# EAGLE design BPC3010_Papilio_Plus (EAGLE 5.11)
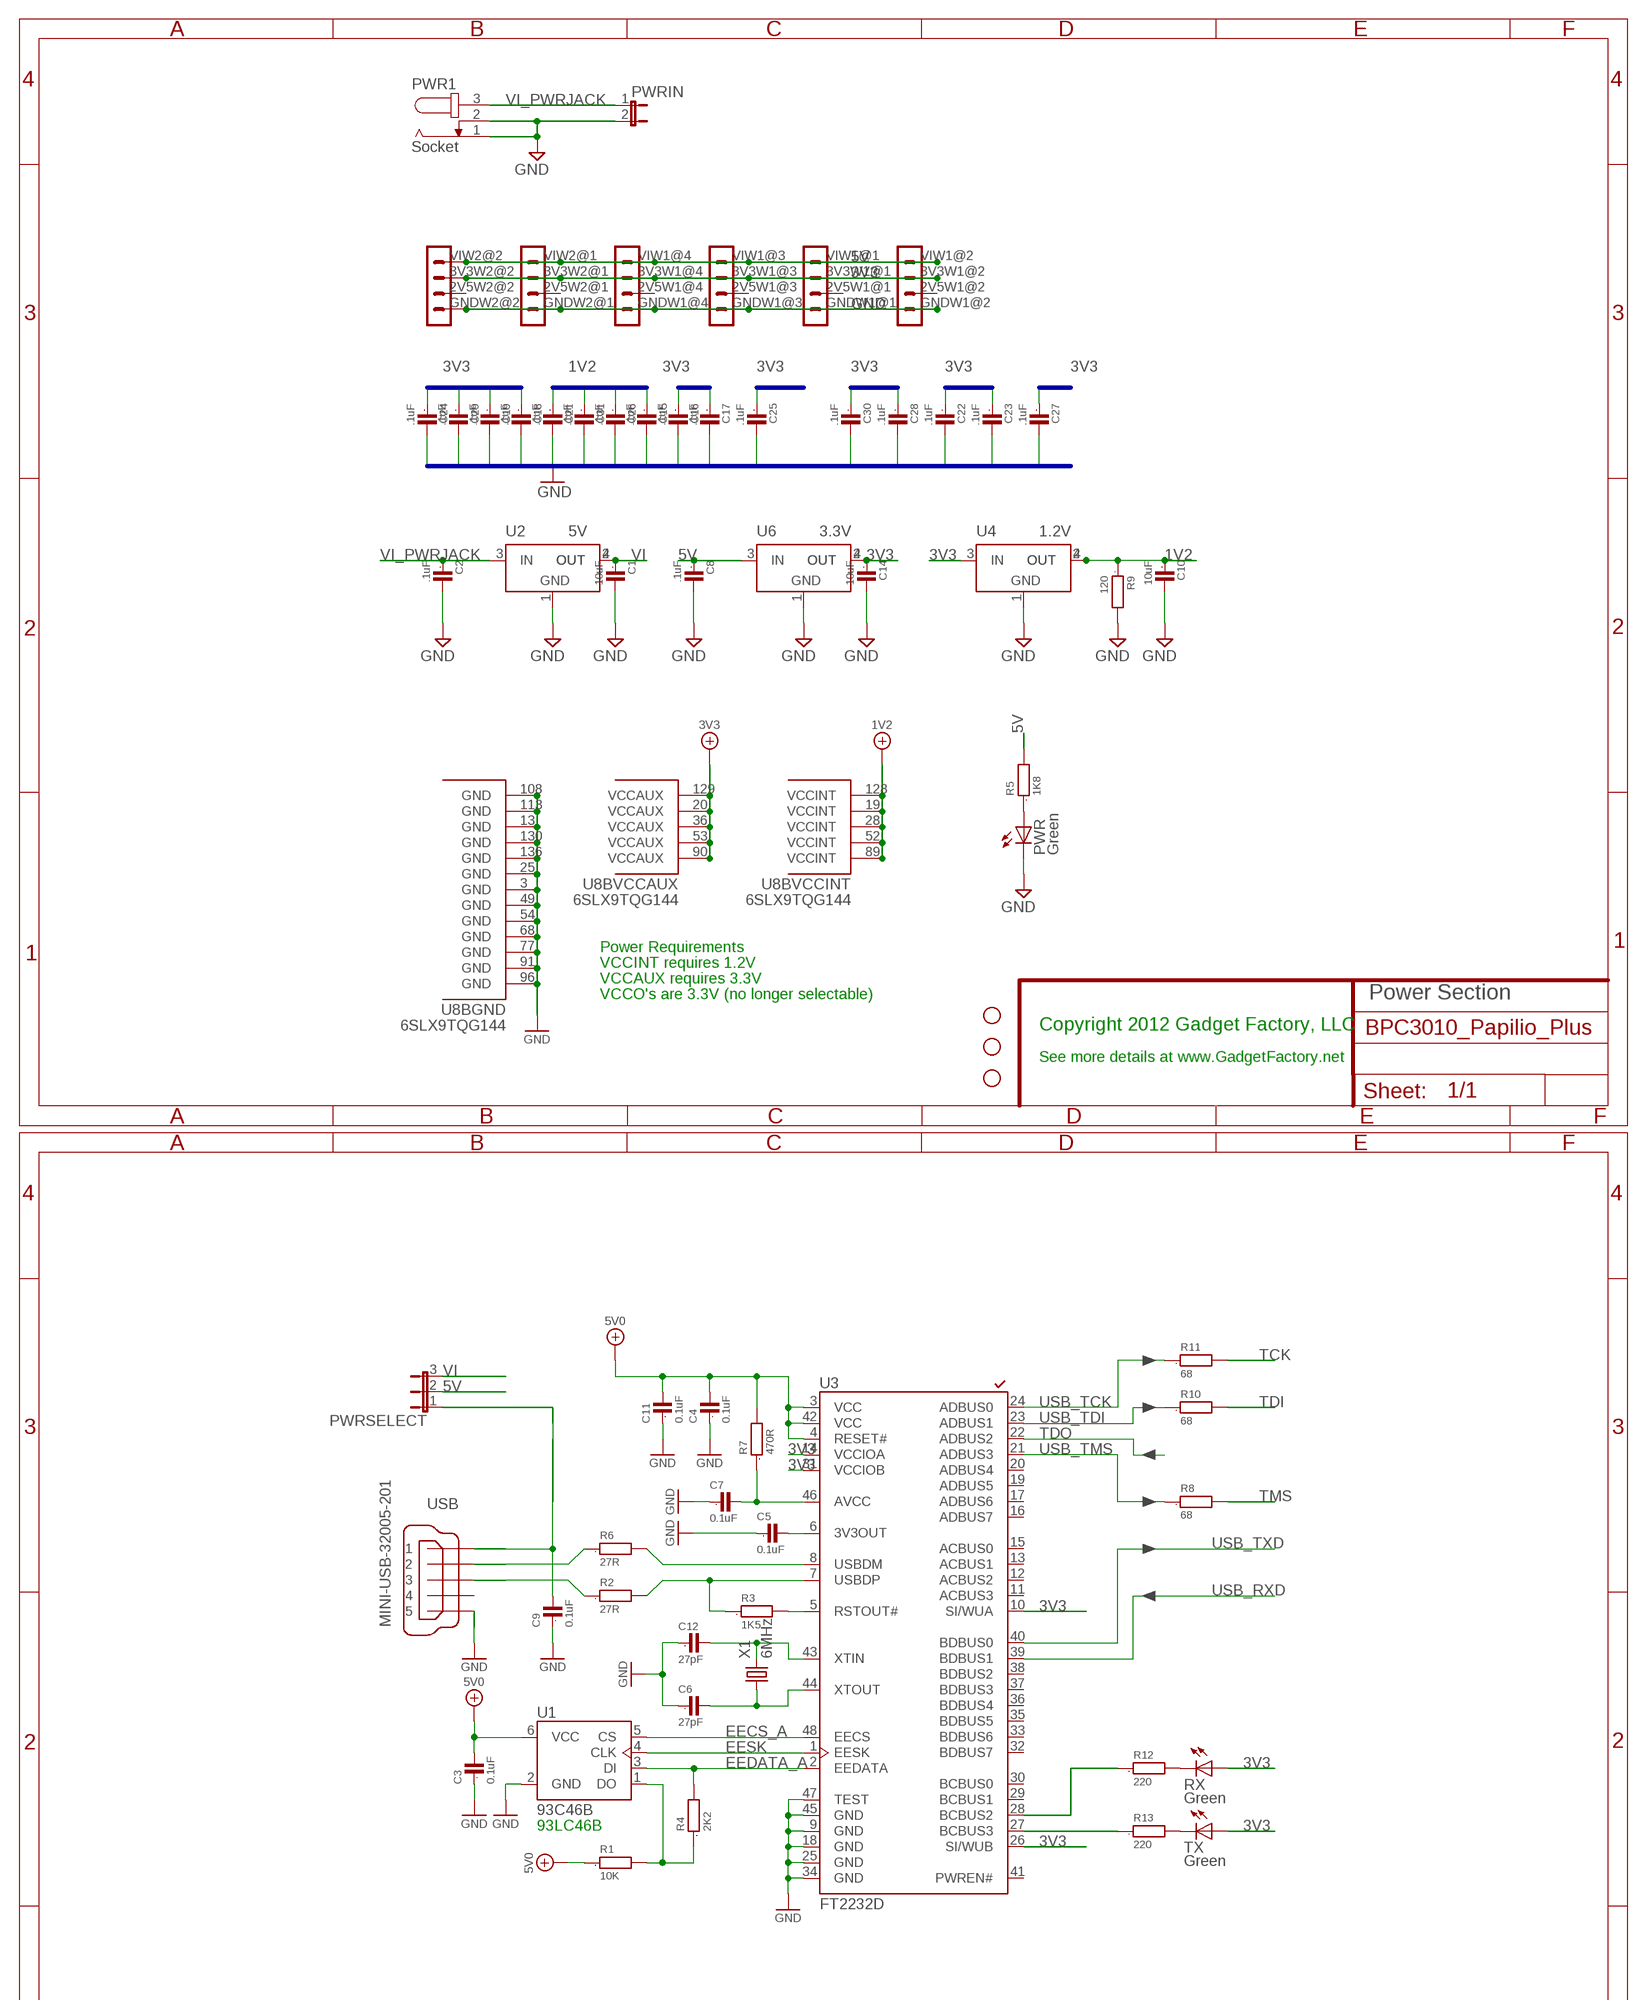
[diagram p0: schematic, sheet 1, part 1 of 2]
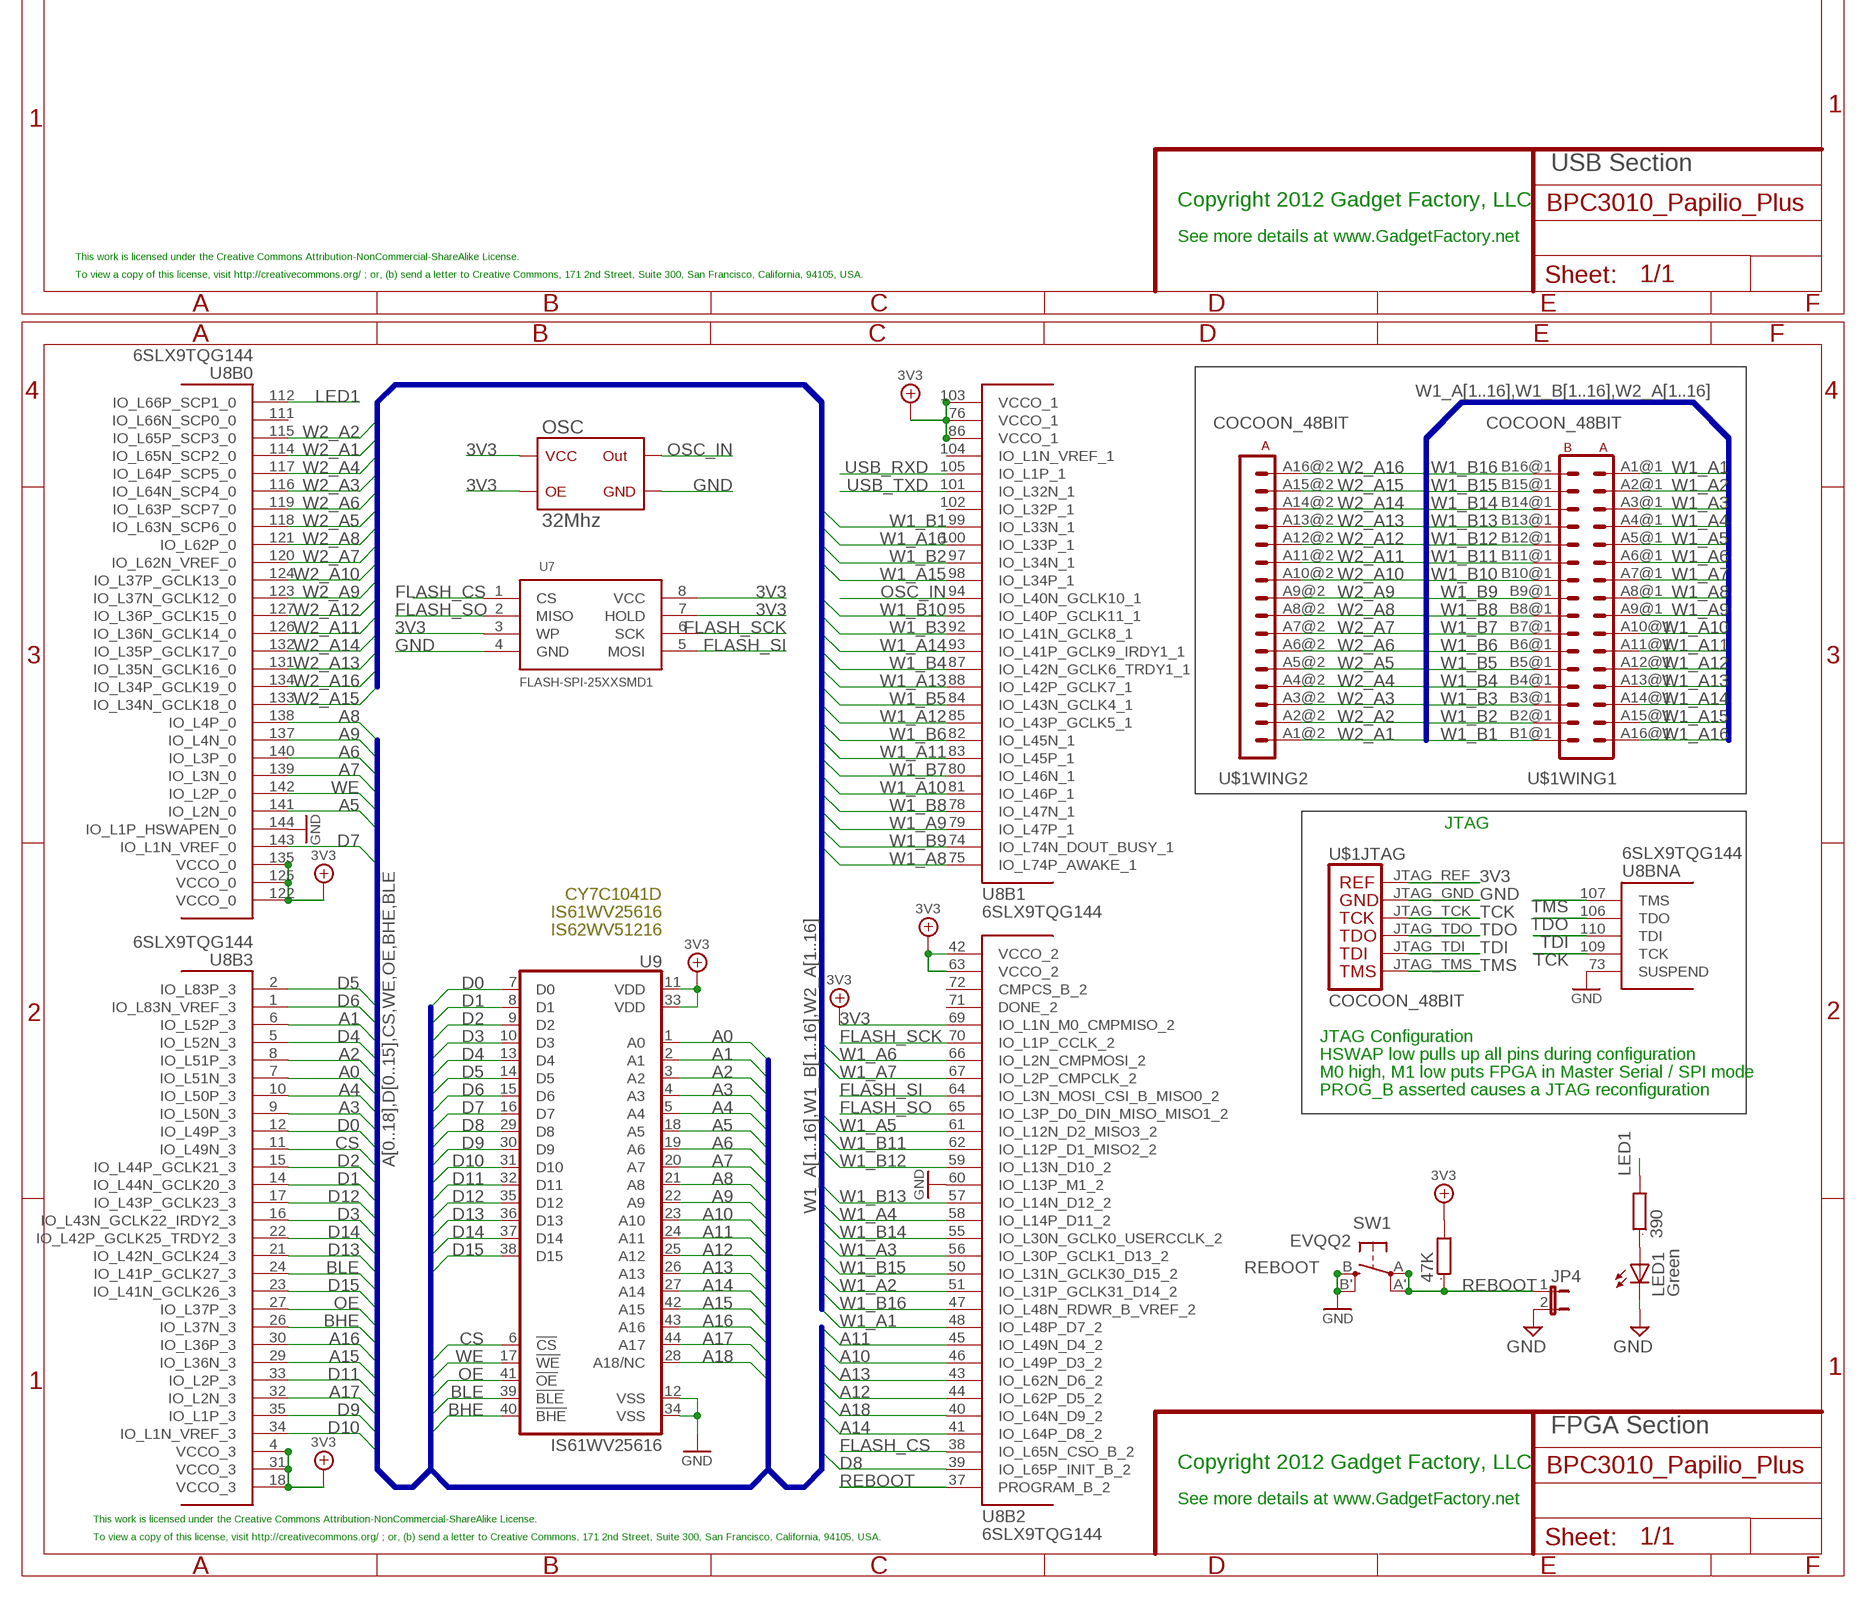
[diagram p1: schematic, sheet 1, part 2 of 2]

## Parts
C1  10uF  C0805  [0805]
C2  .1uF  C0805  [0805]
C3  0.1uF  C0805  [0805@2]
C4  0.1uF  C0805  [0805@2]
C5  0.1uF  C0805  [0805@2]
C6  27pF  C0805  [0805@2]
C7  0.1uF  C0805  [0805@2]
C8  .1uF  C0805  [0805]
C9  0.1uF  C0805  [0805@2]
C10  10uF  C0805  [0805]
C11  0.1uF  C0805  [0805@2]
C12  27pF  C0805  [0805@2]
C14  10uF  C0805  [0805]
C15  .1uF  C0603  [0603]
C16  .1uF  C0603  [0603]
C17  .1uF  C0603  [0603]
C18  .1uF  C0603  [0603]
C19  .1uF  C0603  [0603]
C21  .1uF  C0603  [0603]
C22  .1uF  C0603  [0603]
C23  .1uF  C0603  [0603]
C24  .1uF  C0603  [0603]
C25  .1uF  C0603  [0603]
C26  .1uF  C0603  [0603]
C27  .1uF  C0603  [0603]
C28  .1uF  C0603  [0603]
C29  .1uF  C0603  [0603]
C30  .1uF  C0603  [0603]
C31  .1uF  C0603  [0603]
JP1  STAND-OFF  [STAND-OFF]
JP2  STAND-OFF  [STAND-OFF]
JP3  STAND-OFF  [STAND-OFF]
JP4  JP1E  [JP1]
LED1  Green  LEDCHIPLED_0805  [CHIPLED_0805]
OSC  32Mhz  OSC1  [OSC1]
PWR  Green  LEDCHIP-LED0805  [CHIP-LED0805]
PWR1  Socket  JACK-PLUG  [SPC4078-NOSLOT]
PWRIN  JP1E  [JP1]
PWRSELECT  JP2E  [JP2]
R1  10K  R0805  [0805@1]
R2  27R  R0805  [0805@1]
R3  1K5  R0805  [0805@1]
R4  2K2  R0805  [0805@1]
R5  1K8  R0805  [0805]
R6  27R  R0805  [0805@1]
R7  470R  R0805  [0805@1]
R8  68  R0805  [0805]
R9  120  R0805  [0805@1]
R10  68  R0805  [0805]
R11  68  R0805  [0805]
R12  220  R0805  [0805]
R13  220  R0805  [0805]
R33  47K  R0805  [0805]
R37  390  R0805  [0805]
RX  Green  LEDCHIP-LED0805  [CHIP-LED0805]
SW1  EVQQ2  [EVQ-Q2]
TX  Green  LEDCHIP-LED0805  [CHIP-LED0805]
U1  93C46B  DIGITAL-EEPROM-MICROWIRE-6P_SOT23  [SOT23-6]
U2  5V  LD1117  [SOT223]
U3  FT2232D  [LQFP48]
U4  1.2V  LD1117  [SOT223]
U6  3.3V  LD1117  [SOT223]
U7  FLASH-SPI-25XXSMD1  [SO08-EIAJ]
U8  6SLX9TQG144  [TQ144]
U9  IS61WV25616  DIGITAL_4MB_SRAM  [TSOP44-II]
U$1  COCOON_48BIT  [COCOON_48BIT]
USB  MINI-USB-32005-201  [32005-201]
X1  6MHz  CRYSTALHC49S  [HC49/S]

## Nets
1V2: C10.1 C15.1 C21.1 C26.1 C31.1 R9.1 U4.2(OUT) U4.4(OUT) U8.19(BVCCINT:VCCINT) U8.28(BVCCINT:VCCINT) U8.52(BVCCINT:VCCINT) U8.89(BVCCINT:VCCINT) U8.128(BVCCINT:VCCINT)
3V3: C14.1 C16.1 C17.1 C18.1 C19.1 C22.1 C23.1 C24.1 C25.1 C27.1 C28.1 C29.1 C30.1 OSC.1@1(OE) OSC.4@4(VCC) R33.2 RX.A TX.A U3.10(SI/WUA) U3.14(VCCIOA) U3.26(SI/WUB) U3.31(VCCIOB) U4.3(IN) U6.2(OUT) U6.4(OUT) U7.3(WP) U7.7(HOLD) U7.8(VCC) U8.4(B3:VCCO_3) U8.18(B3:VCCO_3) U8.20(BVCCAUX:VCCAUX) U8.31(B3:VCCO_3) U8.36(BVCCAUX:VCCAUX) U8.42(B2:VCCO_2) U8.53(BVCCAUX:VCCAUX) U8.63(B2:VCCO_2) U8.69(B2:IO_L1N_M0_CMPMISO_2) U8.76(B1:VCCO_1) U8.86(B1:VCCO_1) U8.90(BVCCAUX:VCCAUX) U8.103(B1:VCCO_1) U8.122(B0:VCCO_0) U8.125(B0:VCCO_0) U8.129(BVCCAUX:VCCAUX) U8.135(B0:VCCO_0) U9.11(VDD) U9.33(VDD) U$1.3V3W1@1(3V3) U$1.3V3W1@2(3V3) U$1.3V3W1@3(3V3) U$1.3V3W1@4(3V3) U$1.3V3W2@1(3V3) U$1.3V3W2@2(3V3) U$1.JTAG_REF(JTAG:JTAG_REF)
3V3OUT_A: C5.2 U3.6(3V3OUT)
5V: C3.2 C4.2 C8.1 C11.2 PWRSELECT.2 R1.1 R5.2 R7.2 U1.6(VCC) U3.3(VCC) U3.4(RESET#) U3.42(VCC) U6.3(IN) U$1.VIW1@1(5V) U$1.VIW1@2(5V) U$1.VIW1@3(5V) U$1.VIW1@4(5V) U$1.VIW2@1(5V) U$1.VIW2@2(5V) ; supply symbol labelled 5V0
A0: U8.7(B3:IO_L51N_3) U9.1(A0)
A1: U8.6(B3:IO_L52P_3) U9.2(A1)
A2: U8.8(B3:IO_L51P_3) U9.3(A2)
A3: U8.9(B3:IO_L50N_3) U9.4(A3)
A4: U8.10(B3:IO_L50P_3) U9.5(A4)
A5: U8.141(B0:IO_L2N_0) U9.18(A5)
A6: U8.140(B0:IO_L3P_0) U9.19(A6)
A7: U8.139(B0:IO_L3N_0) U9.20(A7)
A8: U8.138(B0:IO_L4P_0) U9.21(A8)
A9: U8.137(B0:IO_L4N_0) U9.22(A9)
A10: U8.46(B2:IO_L49P_D3_2) U9.23(A10)
A11: U8.45(B2:IO_L49N_D4_2) U9.24(A11)
A12: U8.44(B2:IO_L62P_D5_2) U9.25(A12)
A13: U8.43(B2:IO_L62N_D6_2) U9.26(A13)
A14: U8.41(B2:IO_L64P_D8_2) U9.27(A14)
A15: U8.29(B3:IO_L36N_3) U9.42(A15)
A16: U8.30(B3:IO_L36P_3) U9.43(A16)
A17: U8.32(B3:IO_L2N_3) U9.44(A17)
A18: U8.40(B2:IO_L64N_D9_2) U9.28(A18/NC)
BHE: U8.26(B3:IO_L37N_3) U9.40(!BHE)
BLE: U8.24(B3:IO_L41P_GCLK27_3) U9.39(!BLE)
CS: U8.11(B3:IO_L49N_3) U9.6(!CS)
D0: U8.12(B3:IO_L49P_3) U9.7(D0)
D1: U8.14(B3:IO_L44N_GCLK20_3) U9.8(D1)
D2: U8.15(B3:IO_L44P_GCLK21_3) U9.9(D2)
D3: U8.16(B3:IO_L43N_GCLK22_IRDY2_3) U9.10(D3)
D4: U8.5(B3:IO_L52N_3) U9.13(D4)
D5: U8.2(B3:IO_L83P_3) U9.14(D5)
D6: U8.1(B3:IO_L83N_VREF_3) U9.15(D6)
D7: U8.143(B0:IO_L1N_VREF_0) U9.16(D7)
D8: U8.39(B2:IO_L65P_INIT_B_2) U9.29(D8)
D9: U8.35(B3:IO_L1P_3) U9.30(D9)
D10: U8.34(B3:IO_L1N_VREF_3) U9.31(D10)
D11: U8.33(B3:IO_L2P_3) U9.32(D11)
D12: U8.17(B3:IO_L43P_GCLK23_3) U9.35(D12)
D13: U8.21(B3:IO_L42N_GCLK24_3) U9.36(D13)
D14: U8.22(B3:IO_L42P_GCLK25_TRDY2_3) U9.37(D14)
D15: U8.23(B3:IO_L41N_GCLK26_3) U9.38(D15)
D+: R2.1 USB.3
D-: R6.1 USB.2
DO_A: R1.2 R4.1 U1.1(DO)
EECS_A: U1.5(CS) U3.48(EECS)
EEDATA_A: R4.2 U1.3(DI) U3.2(EEDATA)
EESK: U1.4(CLK) U3.1(EESK)
FILTERED_VCC_A: C7.2 R7.1 U3.46(AVCC)
FLASH_CS: U7.1(CS) U8.38(B2:IO_L65N_CSO_B_2)
FLASH_SCK: U7.6(SCK) U8.70(B2:IO_L1P_CCLK_2)
FLASH_SI: U7.5(MOSI) U8.64(B2:IO_L3N_MOSI_CSI_B_MISO0_2)
FLASH_SO: U7.2(MISO) U8.65(B2:IO_L3P_D0_DIN_MISO_MISO1_2)
GND: C1.2 C2.2 C3.1 C4.1 C5.1 C6.1 C7.1 C8.2 C9.1 C10.2 C11.1 C12.1 C14.2 C15.2 C16.2 C17.2 C18.2 C19.2 C21.2 C22.2 C23.2 C24.2 C25.2 C26.2 C27.2 C28.2 C29.2 C30.2 C31.2 JP4.2 LED1.C OSC.2@2(GND) PWR1.1 PWR1.2 PWR.C PWRIN.2 R9.2 SW1.B'(S1) SW1.B(S) U1.2(GND) U2.1(GND) U3.9(GND) U3.18(GND) U3.25(GND) U3.34(GND) U3.45(GND) U3.47(TEST) U4.1(GND) U6.1(GND) U7.4(GND) U8.3(BGND:GND) U8.13(BGND:GND) U8.25(BGND:GND) U8.49(BGND:GND) U8.54(BGND:GND) U8.60(B2:IO_L13P_M1_2) U8.68(BGND:GND) U8.73(BNA:SUSPEND) U8.77(BGND:GND) U8.91(BGND:GND) U8.96(BGND:GND) U8.108(BGND:GND) U8.113(BGND:GND) U8.130(BGND:GND) U8.136(BGND:GND) U8.144(B0:IO_L1P_HSWAPEN_0) U9.12(VSS) U9.34(VSS) U$1.GNDW1@1(GND) U$1.GNDW1@2(GND) U$1.GNDW1@3(GND) U$1.GNDW1@4(GND) U$1.GNDW2@1(GND) U$1.GNDW2@2(GND) U$1.JTAG_GND(JTAG:JTAG_GND) USB.5
LED1: R37.2 U8.112(B0:IO_L66P_SCP1_0)
N$1: PWR.A R5.1
N$2: R12.2 RX.C
N$3: R13.2 TX.C
N$4: R13.1 U3.27(BCBUS3)
N$5: R12.1 U3.28(BCBUS2)
N$7: LED1.A R37.1
N$15_A: R3.2 U3.5(RSTOUT#)
OE: U8.27(B3:IO_L37P_3) U9.41(!OE)
OSC_IN: OSC.3@3(OUT) U8.94(B1:IO_L40N_GCLK10_1)
REBOOT: JP4.1 R33.1 SW1.A'(P1) SW1.A(P) U8.37(B2:PROGRAM_B_2)
TCK: R11.2 U8.109(BNA:TCK) U$1.JTAG_TCK(JTAG:JTAG_TCK)
TDI: R10.2 U8.110(BNA:TDI) U$1.JTAG_TDI(JTAG:JTAG_TDI)
TDO: U3.22(ADBUS2) U8.106(BNA:TDO) U$1.JTAG_TDO(JTAG:JTAG_TDO)
TMS: R8.2 U8.107(BNA:TMS) U$1.JTAG_TMS(JTAG:JTAG_TMS)
USB_RXD: U3.39(BDBUS1) U8.105(B1:IO_L1P_1)
USB_TCK: R11.1 U3.24(ADBUS0)
USB_TDI: R10.1 U3.23(ADBUS1)
USB_TMS: R8.1 U3.21(ADBUS3)
USB_TXD: U3.40(BDBUS0) U8.101(B1:IO_L32N_1)
USBDM_A: R6.2 U3.8(USBDM)
USBDP_A: R2.2 R3.1 U3.7(USBDP)
VBUS_A: C9.2 PWRSELECT.1 USB.1
VI: C1.1 PWRSELECT.3 U2.2(OUT) U2.4(OUT)
VI_PWRJACK: C2.1 PWR1.3 PWRIN.1 U2.3(IN)
W1_A1: U8.48(B2:IO_L48P_D7_2) U$1.A1@1(WING1:A1)
W1_A2: U8.51(B2:IO_L31P_GCLK31_D14_2) U$1.A2@1(WING1:A2)
W1_A3: U8.56(B2:IO_L30P_GCLK1_D13_2) U$1.A3@1(WING1:A3)
W1_A4: U8.58(B2:IO_L14P_D11_2) U$1.A4@1(WING1:A4)
W1_A5: U8.61(B2:IO_L12N_D2_MISO3_2) U$1.A5@1(WING1:A5)
W1_A6: U8.66(B2:IO_L2N_CMPMOSI_2) U$1.A6@1(WING1:A6)
W1_A7: U8.67(B2:IO_L2P_CMPCLK_2) U$1.A7@1(WING1:A7)
W1_A8: U8.75(B1:IO_L74P_AWAKE_1) U$1.A8@1(WING1:A8)
W1_A9: U8.79(B1:IO_L47P_1) U$1.A9@1(WING1:A9)
W1_A10: U8.81(B1:IO_L46P_1) U$1.A10@1(WING1:A10)
W1_A11: U8.83(B1:IO_L45P_1) U$1.A11@1(WING1:A11)
W1_A12: U8.85(B1:IO_L43P_GCLK5_1) U$1.A12@1(WING1:A12)
W1_A13: U8.88(B1:IO_L42P_GCLK7_1) U$1.A13@1(WING1:A13)
W1_A14: U8.93(B1:IO_L41P_GCLK9_IRDY1_1) U$1.A14@1(WING1:A14)
W1_A15: U8.98(B1:IO_L34P_1) U$1.A15@1(WING1:A15)
W1_A16: U8.100(B1:IO_L33P_1) U$1.A16@1(WING1:A16)
W1_B1: U8.99(B1:IO_L33N_1) U$1.B1@1(WING1:B1)
W1_B2: U8.97(B1:IO_L34N_1) U$1.B2@1(WING1:B2)
W1_B3: U8.92(B1:IO_L41N_GCLK8_1) U$1.B3@1(WING1:B3)
W1_B4: U8.87(B1:IO_L42N_GCLK6_TRDY1_1) U$1.B4@1(WING1:B4)
W1_B5: U8.84(B1:IO_L43N_GCLK4_1) U$1.B5@1(WING1:B5)
W1_B6: U8.82(B1:IO_L45N_1) U$1.B6@1(WING1:B6)
W1_B7: U8.80(B1:IO_L46N_1) U$1.B7@1(WING1:B7)
W1_B8: U8.78(B1:IO_L47N_1) U$1.B8@1(WING1:B8)
W1_B9: U8.74(B1:IO_L74N_DOUT_BUSY_1) U$1.B9@1(WING1:B9)
W1_B10: U8.95(B1:IO_L40P_GCLK11_1) U$1.B10@1(WING1:B10)
W1_B11: U8.62(B2:IO_L12P_D1_MISO2_2) U$1.B11@1(WING1:B11)
W1_B12: U8.59(B2:IO_L13N_D10_2) U$1.B12@1(WING1:B12)
W1_B13: U8.57(B2:IO_L14N_D12_2) U$1.B13@1(WING1:B13)
W1_B14: U8.55(B2:IO_L30N_GCLK0_USERCCLK_2) U$1.B14@1(WING1:B14)
W1_B15: U8.50(B2:IO_L31N_GCLK30_D15_2) U$1.B15@1(WING1:B15)
W1_B16: U8.47(B2:IO_L48N_RDWR_B_VREF_2) U$1.B16@1(WING1:B16)
W2_A1: U8.114(B0:IO_L65N_SCP2_0) U$1.A1@2(WING2:A1)
W2_A2: U8.115(B0:IO_L65P_SCP3_0) U$1.A2@2(WING2:A2)
W2_A3: U8.116(B0:IO_L64N_SCP4_0) U$1.A3@2(WING2:A3)
W2_A4: U8.117(B0:IO_L64P_SCP5_0) U$1.A4@2(WING2:A4)
W2_A5: U8.118(B0:IO_L63N_SCP6_0) U$1.A5@2(WING2:A5)
W2_A6: U8.119(B0:IO_L63P_SCP7_0) U$1.A6@2(WING2:A6)
W2_A7: U8.120(B0:IO_L62N_VREF_0) U$1.A7@2(WING2:A7)
W2_A8: U8.121(B0:IO_L62P_0) U$1.A8@2(WING2:A8)
W2_A9: U8.123(B0:IO_L37N_GCLK12_0) U$1.A9@2(WING2:A9)
W2_A10: U8.124(B0:IO_L37P_GCLK13_0) U$1.A10@2(WING2:A10)
W2_A11: U8.126(B0:IO_L36N_GCLK14_0) U$1.A11@2(WING2:A11)
W2_A12: U8.127(B0:IO_L36P_GCLK15_0) U$1.A12@2(WING2:A12)
W2_A13: U8.131(B0:IO_L35N_GCLK16_0) U$1.A13@2(WING2:A13)
W2_A14: U8.132(B0:IO_L35P_GCLK17_0) U$1.A14@2(WING2:A14)
W2_A15: U8.133(B0:IO_L34N_GCLK18_0) U$1.A15@2(WING2:A15)
W2_A16: U8.134(B0:IO_L34P_GCLK19_0) U$1.A16@2(WING2:A16)
WE: U8.142(B0:IO_L2P_0) U9.17(!WE)
XTIN_A: C12.2 U3.43(XTIN) X1.2
XTOUT_A: C6.2 U3.44(XTOUT) X1.1
Unconnected: U3.11(ACBUS3) U3.12(ACBUS2) U3.13(ACBUS1) U3.15(ACBUS0) U3.16(ADBUS7) U3.17(ADBUS6) U3.19(ADBUS5) U3.20(ADBUS4) U3.29(BCBUS1) U3.30(BCBUS0) U3.32(BDBUS7) U3.33(BDBUS6) U3.35(BDBUS5) U3.36(BDBUS4) U3.37(BDBUS3) U3.38(BDBUS2) U3.41(PWREN#) U8.71(B2:DONE_2) U8.72(B2:CMPCS_B_2) U8.102(B1:IO_L32P_1) U8.104(B1:IO_L1N_VREF_1) U8.111(B0:IO_L66N_SCP0_0) U$1.2V5W1@1(2V5) U$1.2V5W1@2(2V5) U$1.2V5W1@3(2V5) U$1.2V5W1@4(2V5) U$1.2V5W2@1(2V5) U$1.2V5W2@2(2V5) USB.4

## Buses
GND
1V2
W1_A[1..16],W1_B[1..16],W2_A[1..16]
3V3
A[0..18],D[0..15],CS,WE,OE,BHE,BLE

## Notes on the sheet
- Power Requirements
- VCCINT requires 1.2V
- VCCAUX requires 3.3V
- VCCO's are 3.3V (no longer selectable) | Power Section
- Copyright 2012 Gadget Factory, LLC
- See more details at www.GadgetFactory.net
- 93LC46B
- USB Section
- Copyright 2012 Gadget Factory, LLC
- See more details at www.GadgetFactory.net
- This work is licensed under the Creative Commons Attribution-NonCommercial-ShareAlike License.
- To view a copy of this license, visit http://creativecommons.org/ ; or, (b) send a letter to Creative Commons, 171 2nd Street, Suite 300, San Francisco, California, 94105, USA.
- JTAG
- CY7C1041D
- IS61WV25616
- IS62WV51216
- JTAG Configuration
- HSWAP low pulls up all pins during configuration
- M0 high, M1 low puts FPGA in Master Serial / SPI mode
- PROG_B asserted causes a JTAG reconfiguration
- REBOOT
- FPGA Section
- Copyright 2012 Gadget Factory, LLC
- See more details at www.GadgetFactory.net
- This work is licensed under the Creative Commons Attribution-NonCommercial-ShareAlike License.
- To view a copy of this license, visit http://creativecommons.org/ ; or, (b) send a letter to Creative Commons, 171 2nd Street, Suite 300, San Francisco, California, 94105, USA.

## Library data of the parts
C1 C2 C8 C10 C14-C19 C21-C31 = GadgetFactory:C: CAPACITOR, European symbol
C3-C7 C9 C11 C12 = Bogdan_Commons:C: CAPACITOR, European symbol
JP1-JP3 = GadgetFactory_Pub - Copy:STAND-OFF: Stand Off This is the mechanical footprint for a #4 phillips button head screw. Use the keepout ring to avoid running the screw head into surrounding components. SKU : PRT-00447
JP4 PWRIN = jumper:JP1E: JUMPER
LED1 PWR RX TX = led:LED: LED OSRAM: - CHIPLED LG R971, LG N971, LY N971, LG Q971, LY Q971, LO R971, LY R971 LH N974, LH R974 LS Q976, LO Q976, LY Q976 LO Q996 - Hyper CHIPLED LW Q18S LB Q993, LB Q99A, LB R99A - SideLED LS A670, LO A670, LY A670, LG A670, LP A670 LB A673, LV A673, LT A673, LW A673 LH A674 LY A675 LS A676, LA A676, LO A676, LY A676, LW A676 LS A679, LY A679, LG A679 - Hyper Micro SIDELED® LS Y876, LA Y876, LO Y876, LY Y876 LT Y87S - SmartLED LW L88C, LW L88S LB L89C, LB L89S, LG L890 LS L89K, LO L89K, LY L89K LS L896, LA L896, LO L896, LY L896 - TOPLED LS T670, LO T670, LY T670, LG T670, LP T670 LSG T670, LSP T670, LSY T670, LOP T670, LYG T670 LG T671, LOG T671, LSG T671 LB T673, LV T673, LT T673, LW T673 LH T674 LS T676, LA T676, LO T676, LY T676, LB T676, LH T676, LSB T676, LW T676 LB T67C, LV T67C, LT T67C, LS T67K, LO T67K, LY T67K, LW E67C LS E67B, LA E67B, LO E67B, LY E67B, LB E67C, LV E67C, LT E67C LW T67C LS T679, LY T679, LG T679 LS T770, LO T770, LY T770, LG T770, LP T770 LB T773, LV T773, LT T773, LW T773 LH T774 LS E675, LA E675, LY E675, LS T675 LS T776, LA T776, LO T776, LY T776, LB T776 LHGB T686 LT T68C, LB T68C - Hyper Mini TOPLED® LB M676 - Mini TOPLED Santana® LG M470 LS M47K, LO M47K, LY M47K Source: http://www.osram.convergy.de LUXEON: - LUMILED® LXK2-PW12-R00, LXK2-PW12-S00, LXK2-PW14-U00, LXK2-PW14-V00 LXK2-PM12-R00, LXK2-PM12-S00, LXK2-PM14-U00 LXK2-PE12-Q00, LXK2-PE12-R00, LXK2-PE12-S00, LXK2-PE14-T00, LXK2-PE14-U00 LXK2-PB12-K00, LXK2-PB12-L00, LXK2-PB12-M00, LXK2-PB14-N00, LXK2-PB14-P00, LXK2-PB14-Q00 LXK2-PR12-L00, LXK2-PR12-M00, LXK2-PR14-Q00, LXK2-PR14-R00 LXK2-PD12-Q00, LXK2-PD12-R00, LXK2-PD12-S00 LXK2-PH12-R00, LXK2-PH12-S00 LXK2-PL12-P00, LXK2-PL12-Q00, LXK2-PL12-R00 Source: www.luxeon.com KINGBRIGHT: KA-3528ASYC Source: www.kingbright.com
OSC = MondoCPLDCore-XC95_Rev1.5:OSC1
PWR1 = GadgetFactory:JACK-PLUG: DC POWER JACK Power Jack, DC, Right Angle, Through Hole, Rated 5A at 16VDC, PC Terminals Distributor: Farnell (www.Farnell.de) Drawing: 84N1161.pdf / 84N1162.pdf Manufacturer: SPC Technology (www.spctechnology.com) Type: SPC4077 / SPC 4078
PWRSELECT = jumper:JP2E: JUMPER
R1-R4 R6 R7 R9 = Bogdan_Commons:R: RESISTOR, European symbol
R5 R8 R10-R13 R33 R37 = GadgetFactory:R: RESISTOR, European symbol
SW1 = adafruit:EVQQ2: SMT 6mm switch, EVQQ2 series http://www.ladyada.net/library/eagle
U1 = Bogdan_Commons:DIGITAL-EEPROM-MICROWIRE-6P
U2 U4 U6 = GadgetFactory:LD1117
U3 = Bogdan_Commons:FT2232D
U7 = GadgetFactory:FLASH-SPI-25XX: SPI Flash
U8 = xilinx_devices:6SLX9TQG144: Xilinx FPGA: 6SLX9TQG144
U9 = Bogdan_Commons:DIGITAL_4MB_SRAM
U$1 = GadgetFactory_Pub:COCOON_48BIT
USB = con-cypressindustries:MINI-USB-: MINI USB-B Conector Source: www.cypressindustries.com
X1 = crystal:CRYSTAL: CRYSTAL

## Net classes
0 default: width 0.178 mm, drill 0.381 mm, clearance 0.178 mm
1 Power: width 0.813 mm, drill 0.381 mm, clearance 0.178 mm

## Board
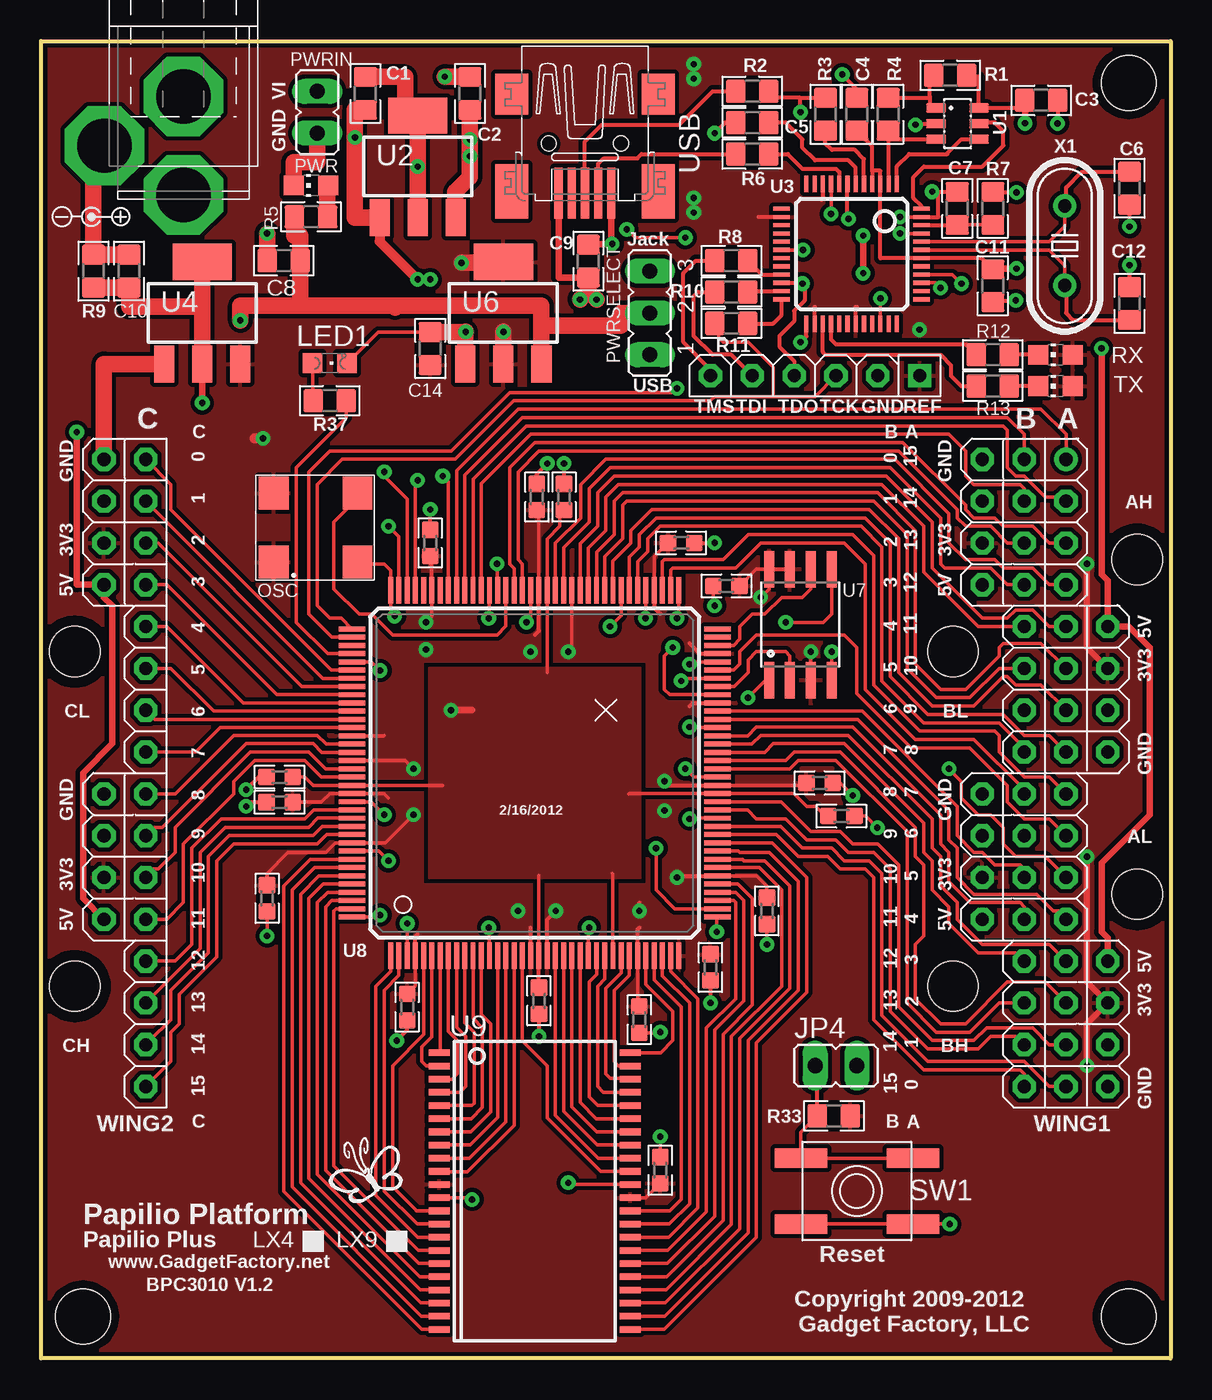
[diagram p2: board, top side]
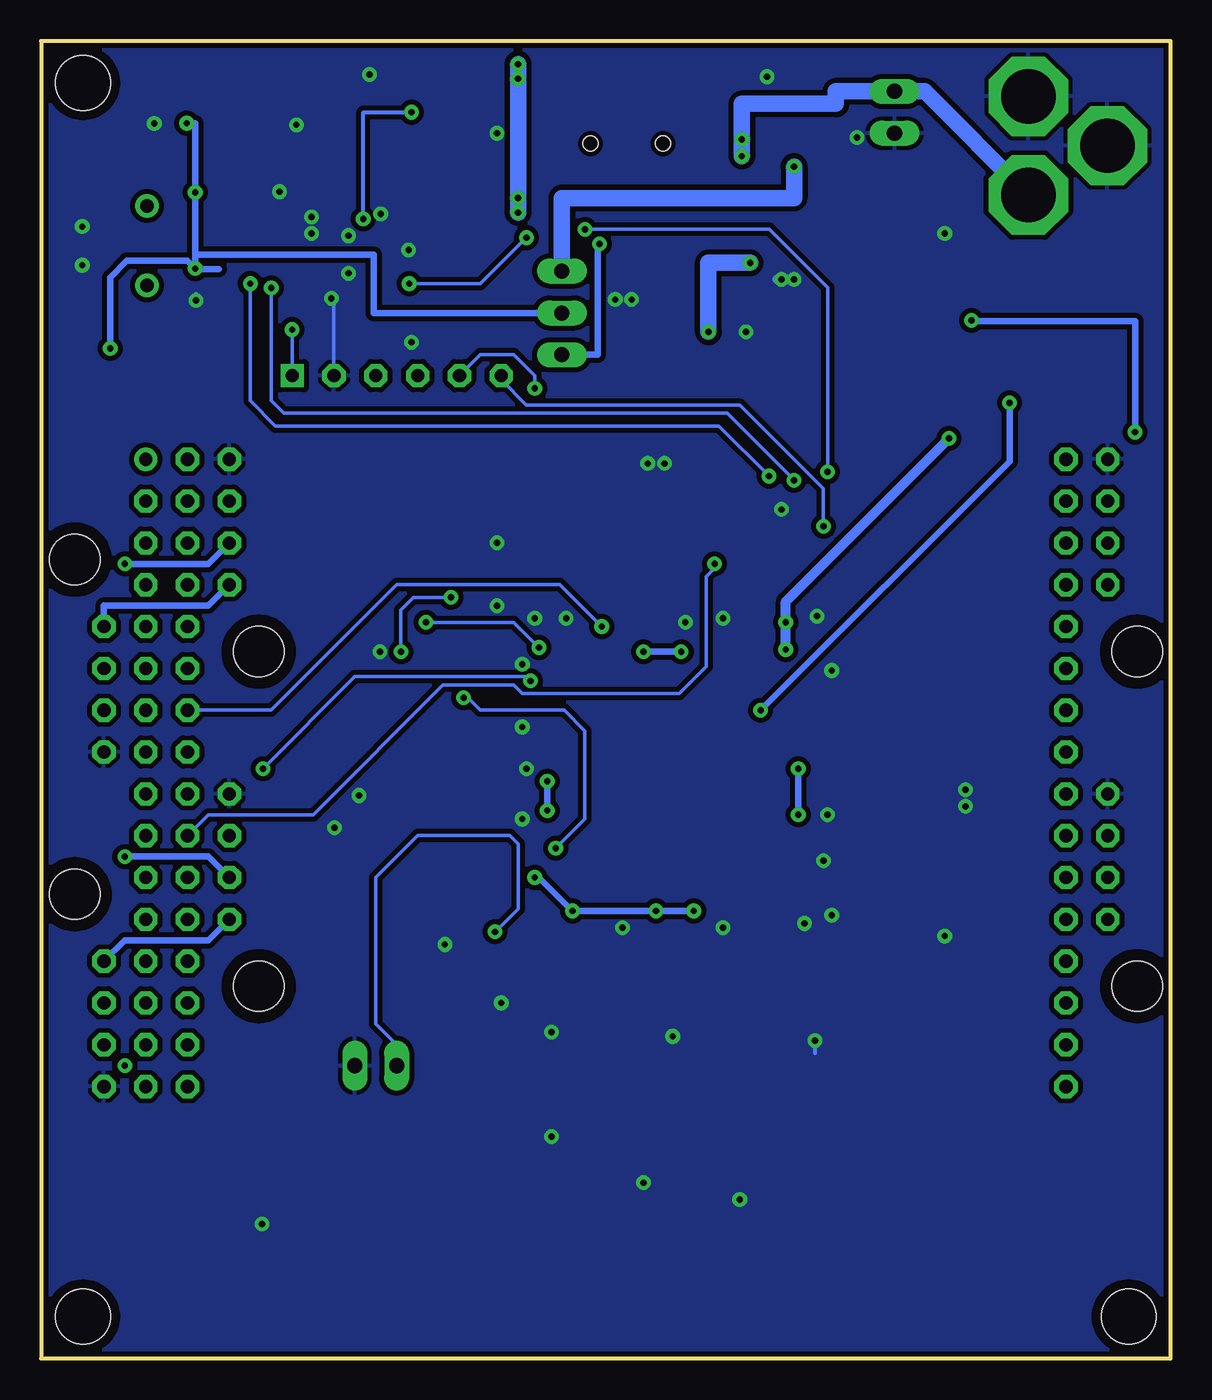
[diagram p3: board, bottom side, seen from below]

Size 68.58 x 80.01 mm. Coordinates in mm from the lower left corner, seen from the top.
Outline: 0,80.01 68.58,80.01 68.58,0 0,0 0,80.01
Copper layers (1*16): Top 0.035mm / dielectric 1.5mm / Bottom 0.035mm
Design rules "SparkFun_Derived_GoldePheonix_7mil *": minimum track width 7mil, minimum drill 15mil, track to track 7mil, track to pad 7mil, pad to pad 7mil, via to via 7mil, smd to smd 7mil, copper to edge 7mil, drill to drill 7mil, minimum pad ring 12mil, minimum via ring 10mil, stop-mask expansion 4mil, vias tented up to drill 18mil, thermal gap 10mil

### Footprints (pad centres in the part's own frame; a part is rotated, then mirrored left to right if it is on the bottom)
0805 = smd 1.2 x 1.4: 1 -1,0; 2 1,0
0805@2 = smd 1.2 x 1.4: 1 -1,0; 2 1,0
0603 = smd 1 x 1: 1 -0.8,0; 2 0.8,0
STAND-OFF = hole 3.302: 0,0
JP1 = drill 0.914 long: 1 0,-1.27; 2 0,1.27
CHIPLED_0805 = smd 1.2 x 1.2: A 0,-1.05; C 0,1.05
OSC1 = smd 1.8 x 2: 1@1 0,0; 2@2 5.08,0; 3@3 5.08,4.2; 4@4 0,4.2
CHIP-LED0805 = smd 1.2 x 1.2: A 0,-1.05; C 0,1.05
SPC4078-NOSLOT = drill 3.302 pad 4.826 octagon: 1 -3,0; 2 0,-4.8; 3 3,0
JP2 = drill 0.914 long: 1 -2.54,0; 2 0,0; 3 2.54,0
0805@1 = smd 1.2 x 1.4: 1 -1,0; 2 1,0
EVQ-Q2 = smd 3.2 x 1.2: A -3.4,-2; A' 3.4,-2; B -3.4,2; B' 3.4,2
SOT23-6 = smd 0.55 x 1.2: 1 -0.95,-1.3; 2 0,-1.3; 3 0.95,-1.3; 4 0.95,1.3; 5 0,1.3; 6 -0.95,1.3
SOT223 = smd 1.219 x 2.235: 1 -2.311,-3.099; 2 0,-3.099; 3 2.311,-3.099 | smd 3.6 x 2.2: 4 0,3.099
LQFP48 = smd 0.25 x 1: 1 -2.75,-4.25; 2 -2.25,-4.25; 3 -1.75,-4.25; 4 -1.25,-4.25; 5 -0.75,-4.25; 6 -0.25,-4.25; 7 0.25,-4.25; 8 0.75,-4.25; 9 1.25,-4.25; 10 1.75,-4.25; 11 2.25,-4.25; 12 2.75,-4.25; 25 2.75,4.25; 26 2.25,4.25; 27 1.75,4.25; 28 1.25,4.25; 29 0.75,4.25; 30 0.25,4.25; 31 -0.25,4.25; 32 -0.75,4.25; 33 -1.25,4.25; 34 -1.75,4.25; 35 -2.25,4.25; 36 -2.75,4.25 | smd 1 x 0.25: 13 4.25,-2.75; 14 4.25,-2.25; 15 4.25,-1.75; 16 4.25,-1.25; 17 4.25,-0.75; 18 4.25,-0.25; 19 4.25,0.25; 20 4.25,0.75; 21 4.25,1.25; 22 4.25,1.75; 23 4.25,2.25; 24 4.25,2.75; 37 -4.25,2.75; 38 -4.25,2.25; 39 -4.25,1.75; 40 -4.25,1.25; 41 -4.25,0.75; 42 -4.25,0.25; 43 -4.25,-0.25; 44 -4.25,-0.75; 45 -4.25,-1.25; 46 -4.25,-1.75; 47 -4.25,-2.25; 48 -4.25,-2.75
SO08-EIAJ = smd 0.61 x 2.21: 1 -1.905,-3.378; 2 -0.635,-3.378; 3 0.635,-3.378; 4 1.905,-3.378; 5 1.905,3.353; 6 0.635,3.353; 7 -0.635,3.353; 8 -1.905,3.353
TQ144 = smd 1.6 x 0.3: 1 -11.1,8.75; 2 -11.1,8.25; 3 -11.1,7.75; 4 -11.1,7.25; 5 -11.1,6.75; 6 -11.1,6.25; 7 -11.1,5.75; 8 -11.1,5.25; 9 -11.1,4.75; 10 -11.1,4.25; 11 -11.1,3.75; 12 -11.1,3.25; 13 -11.1,2.75; 14 -11.1,2.25; 15 -11.1,1.75; 16 -11.1,1.25; 17 -11.1,0.75; 18 -11.1,0.25; 19 -11.1,-0.25; 20 -11.1,-0.75; 21 -11.1,-1.25; 22 -11.1,-1.75; 23 -11.1,-2.25; 24 -11.1,-2.75; 25 -11.1,-3.25; 26 -11.1,-3.75; 27 -11.1,-4.25; 28 -11.1,-4.75; 29 -11.1,-5.25; 30 -11.1,-5.75; 31 -11.1,-6.25; 32 -11.1,-6.75; 33 -11.1,-7.25; 34 -11.1,-7.75; 35 -11.1,-8.25; 36 -11.1,-8.75; 73 11.1,-8.75; 74 11.1,-8.25; 75 11.1,-7.75; 76 11.1,-7.25; 77 11.1,-6.75; 78 11.1,-6.25; 79 11.1,-5.75; 80 11.1,-5.25; 81 11.1,-4.75; 82 11.1,-4.25; 83 11.1,-3.75; 84 11.1,-3.25; 85 11.1,-2.75; 86 11.1,-2.25; 87 11.1,-1.75; 88 11.1,-1.25; 89 11.1,-0.75; 90 11.1,-0.25; 91 11.1,0.25; 92 11.1,0.75; 93 11.1,1.25; 94 11.1,1.75; 95 11.1,2.25; 96 11.1,2.75; 97 11.1,3.25; 98 11.1,3.75; 99 11.1,4.25; 100 11.1,4.75; 101 11.1,5.25; 102 11.1,5.75; 103 11.1,6.25; 104 11.1,6.75; 105 11.1,7.25; 106 11.1,7.75; 107 11.1,8.25; 108 11.1,8.75 | smd 0.3 x 1.6: 37 -8.75,-11.1; 38 -8.25,-11.1; 39 -7.75,-11.1; 40 -7.25,-11.1; 41 -6.75,-11.1; 42 -6.25,-11.1; 43 -5.75,-11.1; 44 -5.25,-11.1; 45 -4.75,-11.1; 46 -4.25,-11.1; 47 -3.75,-11.1; 48 -3.25,-11.1; 49 -2.75,-11.1; 50 -2.25,-11.1; 51 -1.75,-11.1; 52 -1.25,-11.1; 53 -0.75,-11.1; 54 -0.25,-11.1; 55 0.25,-11.1; 56 0.75,-11.1; 57 1.25,-11.1; 58 1.75,-11.1; 59 2.25,-11.1; 60 2.75,-11.1; 61 3.25,-11.1; 62 3.75,-11.1; 63 4.25,-11.1; 64 4.75,-11.1; 65 5.25,-11.1; 66 5.75,-11.1; 67 6.25,-11.1; 68 6.75,-11.1; 69 7.25,-11.1; 70 7.75,-11.1; 71 8.25,-11.1; 72 8.75,-11.1; 109 8.75,11.1; 110 8.25,11.1; 111 7.75,11.1; 112 7.25,11.1; 113 6.75,11.1; 114 6.25,11.1; 115 5.75,11.1; 116 5.25,11.1; 117 4.75,11.1; 118 4.25,11.1; 119 3.75,11.1; 120 3.25,11.1; 121 2.75,11.1; 122 2.25,11.1; 123 1.75,11.1; 124 1.25,11.1; 125 0.75,11.1; 126 0.25,11.1; 127 -0.25,11.1; 128 -0.75,11.1; 129 -1.25,11.1; 130 -1.75,11.1; 131 -2.25,11.1; 132 -2.75,11.1; 133 -3.25,11.1; 134 -3.75,11.1; 135 -4.25,11.1; 136 -4.75,11.1; 137 -5.25,11.1; 138 -5.75,11.1; 139 -6.25,11.1; 140 -6.75,11.1; 141 -7.25,11.1; 142 -7.75,11.1; 143 -8.25,11.1; 144 -8.75,11.1
TSOP44-II = smd 0.4 x 1.3: 1 -8.4,-5.8; 2 -7.6,-5.8; 3 -6.8,-5.8; 4 -6,-5.8; 5 -5.2,-5.8; 6 -4.4,-5.8; 7 -3.6,-5.8; 8 -2.8,-5.8; 9 -2,-5.8; 10 -1.2,-5.8; 11 -0.4,-5.8; 12 0.4,-5.8; 13 1.2,-5.8; 14 2,-5.8; 15 2.8,-5.8; 16 3.6,-5.8; 17 4.4,-5.8; 18 5.2,-5.8; 19 6,-5.8; 20 6.8,-5.8; 21 7.6,-5.8; 22 8.4,-5.8; 23 8.4,5.8; 24 7.6,5.8; 25 6.8,5.8; 26 6,5.8; 27 5.2,5.8; 28 4.4,5.8; 29 3.6,5.8; 30 2.8,5.8; 31 2,5.8; 32 1.2,5.8; 33 0.4,5.8; 34 -0.4,5.8; 35 -1.2,5.8; 36 -2,5.8; 37 -2.8,5.8; 38 -3.6,5.8; 39 -4.4,5.8; 40 -5.2,5.8; 41 -6,5.8; 42 -6.8,5.8; 43 -7.6,5.8; 44 -8.4,5.8
COCOON_48BIT = drill 0.8 octagon: 2V5W1@1 57.15,40.64; 2V5W1@2 64.77,27.94; 2V5W1@3 57.15,20.32; 2V5W1@4 64.77,7.62; 2V5W2@1 3.81,40.64; 2V5W2@2 3.81,20.32; 3V3W1@1 57.15,38.1; 3V3W1@2 64.77,30.48; 3V3W1@3 57.15,17.78; 3V3W1@4 64.77,10.16; 3V3W2@1 3.81,38.1; 3V3W2@2 3.81,17.78; A1@1 62.23,5.08; A1@2 6.35,43.18; A2@1 62.23,7.62; A2@2 6.35,40.64; A3@1 62.23,10.16; A3@2 6.35,38.1; A4@1 62.23,12.7; A4@2 6.35,35.56; A5@1 62.23,15.24; A5@2 6.35,33.02; A6@1 62.23,17.78; A6@2 6.35,30.48; A7@1 62.23,20.32; A7@2 6.35,27.94; A8@1 62.23,22.86; A8@2 6.35,25.4; A9@1 62.23,25.4; A9@2 6.35,22.86; A10@1 62.23,27.94; A10@2 6.35,20.32; A11@1 62.23,30.48; A11@2 6.35,17.78; A12@1 62.23,33.02; A12@2 6.35,15.24; A13@1 62.23,35.56; A13@2 6.35,12.7; A14@1 62.23,38.1; A14@2 6.35,10.16; A15@1 62.23,40.64; A15@2 6.35,7.62; A16@2 6.35,5.08; B1@1 59.69,43.18; B2@1 59.69,40.64; B3@1 59.69,38.1; B4@1 59.69,35.56; B5@1 59.69,33.02; B6@1 59.69,30.48; B7@1 59.69,27.94; B8@1 59.69,25.4; B9@1 59.69,22.86; B10@1 59.69,20.32; B11@1 59.69,17.78; B12@1 59.69,15.24; B13@1 59.69,12.7; B14@1 59.69,10.16; B15@1 59.69,7.62; B16@1 59.69,5.08; GNDW1@1 57.15,43.18; GNDW1@2 64.77,25.4; GNDW1@3 57.15,22.86; GNDW1@4 64.77,5.08; GNDW2@1 3.81,43.18; GNDW2@2 3.81,22.86; JTAG_GND 50.8,48.26; JTAG_TCK 48.26,48.26; JTAG_TDI 43.18,48.26; JTAG_TDO 45.72,48.26; JTAG_TMS 40.64,48.26; VIW1@1 57.15,35.56; VIW1@2 64.77,33.02; VIW1@3 57.15,15.24; VIW1@4 64.77,12.7; VIW2@1 3.81,35.56; VIW2@2 3.81,15.24 | drill 0.8 round: A16@1 62.23,43.18 | drill 0.8 square: JTAG_REF 53.34,48.26 | hole 3.048: 2.032,31.496; 2.032,11.176; 55.372,11.176; 66.548,16.764; 55.372,31.496; 66.548,37.084
32005-201 = smd 3.1 x 0.5: 1 3,1.6; 2 3,0.8; 3 3,0; 4 3,-0.8; 5 3,-1.6 | smd 2.5 x 2: M1 -3,-4.45; M2 -3,4.45 | smd 3.3 x 2: M3 2.9,4.45; M4 2.9,-4.45 | hole 0.9: 0,2.2; 0,-2.2
HC49/S = drill 0.813 round: 1 -2.413,0; 2 2.413,0

### Placement (x,y rotation side)
C1  19.68,76.83 270 top
C2  26.04,76.83 90 top
C3  60.72,76.41 180 top
C4  49.53,75.56 270 top
C5  43.18,75.06 0 top
C6  66.09,71.08 90 top
C7  55.63,69.85 270 top
C8  14.73,66.67 180 top
C9  33.23,66.64 90 top
C10  5.33,66.04 90 top
C11  57.78,65.15 90 top
C12  66.09,64.08 270 top
C14  23.62,61.34 90 top
C15  31.75,52.32 90 top
C16  38.86,49.53 0 top
C17  23.62,49.53 90 top
C18  40.64,23.75 270 top
C19  47.27,34.95 0 top
C21  48.59,32.94 0 top
C22  13.72,27.94 270 top
C23  36.32,20.57 270 top
C24  30.1,52.32 90 top
C25  44.07,27.18 270 top
C26  30.23,21.72 270 top
C27  41.61,46.91 180 top
C28  22.23,21.34 270 top
C29  14.48,33.78 180 top
C30  37.59,11.43 90 top
C31  14.48,35.31 180 top
JP1  2.54,2.54 0 top
JP2  66.04,2.54 0 top
JP3  66.04,77.47 0 top
JP4  48.26,17.78 270 top
LED1  17.53,60.45 270 top
OSC  14.12,48.36 0 top
PWR  16.38,71.25 90 top
PWR1  8.64,73.66 270 top
PWRIN  16.76,75.69 180 top
PWRSELECT  36.96,63.5 90 top
R1  55.2,77.94 180 top
R2  43.18,76.96 0 top
R3  47.62,75.56 270 top
R4  51.44,75.56 270 top
R5  16.38,69.34 180 top
R6  43.18,73.15 0 top
R7  57.78,69.85 90 top
R8  41.91,66.67 180 top
R9  3.17,66.04 90 top
R10  41.91,64.77 180 top
R11  41.91,62.87 180 top
R12  57.78,60.96 0 top
R13  57.78,59.05 0 top
R33  48.13,14.73 0 top
R37  17.53,58.17 0 top
RX  61.59,60.96 90 top
SW1  49.53,10.16 180 top
TX  61.59,59.05 90 top
U1  55.65,75 270 top
U2  22.86,72.39 0 top
U3  49.21,67.08 180 top
U4  9.78,63.5 0 top
U6  28.07,63.5 0 top
U7  46.1,44.58 0 top
U8  29.97,35.56 90 top
U9  29.97,10.16 270 top
U$1  0,11.43 0 top
U$2  [TIP_POS_POLARITY]  3.05,69.34 0 top
U$3  [GADGETFACTORY_LOGO]  17.27,8.89 0 top
U$4  [LX9_SIZE]  12.83,6.73 0 top
USB  33.02,73.79 270 top
X1  62.15,67.58 270 top

### Tracks (layer width: path | path; a pad name or v marks a point on that pad's centre or on a via)
1V2  (via drill 0.38)
  Top 0.203: 24.37,34.81 U8.128 16.52,34.81 16.51,34.8 16,35.31 C31.1 | 35.69,34.29 35.71,34.31 U8.52 45.7,34.31 46.48,33.53 47.03,33.53 47.61,32.94 C21.1 | U8.28 34.72,29.41 34.67,29.46 | U8.19 30.22,29.33 30.23,29.34 | C15.1 31.75,51.56 31.5,51.56 31.5,50.55 30.72,49.77 U8.89 30.72,41.67 30.73,41.66
  Top 0.254: C26.1 U8.19
  Top 0.406: v9.78,58.04 U4.2 | v24.89,39.37 26.16,39.37
  Top 1.016: R9.1 C10.1 5.33,63.88 9.78,63.88 | U4.2 9.78,63.88 | 9.78,63.88 U4.4
  Bottom 0.406: v9.78,58.04 9.78,54.48 v24.89,39.37
  pour Top (rank 2): 23.62,41.91 36.32,41.91 36.32,29.21 23.62,29.21
3V3  (via drill 0.38)
  Top 0.203: C29.1 17.02,33.78 17.55,34.31 U8.129 20.81,34.31 21.08,34.04 | U8.31 36.22,21.47 C23.1 | U9.33 36.72,9.76 C30.1 | U8.53 46.33,34.81 C19.1 | U8.76 37.22,48.69 C16.1 | C27.1 43.42,47.93 U7.8 44.2,46.74 v43.69,46.23 | U7.3 v46.74,42.93 | v53.34,62.48 53.34,62.74 | U8.122 20.79,37.81 20.83,37.85 | U8.125 22.11,36.31 v22.61,35.81 | v22.61,33.02 20.9,31.31 U8.135 17.85,31.31 17.27,30.73 14.99,30.73 13.72,29.46 C22.1 | U8.103 23.72,45.06 v23.37,44.7 | U8.86 32.22,43.14 v32,42.93 | U8.90 30.22,51.4 C24.1 | U8.4 22.72,22.63 C28.1 | U8.42 43.46,29.31 44.07,28.7 C25.1
  Top 0.254: U3.14 43.56,69.33 | U3.26 46.96,63.88 46.99,63.88 | U3.31 49.46,63.88 49.53,63.88 | U3.10 47.46,70.45 47.37,70.36 | U7.8 U7.7 | U8.103 23.72,48.63 C17.1 | U8.122 18.84,37.85 | U8.4 22.72,25.64 22.86,25.78 | U8.18 29.72,26.16 | U8.20 30.72,26.66 v31.24,27.18 | v28.96,27.18 28.96,27.43 | v36.32,27.18 36.32,27.69 | U8.31 36.22,26.06 36.32,26.16 | U8.42 38.71,29.31 v38.61,29.21 | U8.53 40.91,34.81 40.89,34.8 38.1,34.8 v37.85,35.05 | v37.85,33.27 37.85,33.02 | U8.63 39.56,39.81 39.37,39.62 | U8.69 39.99,42.81 39.37,43.43 | U8.76 37.22,45.58 37.59,45.21 | U8.90 30.22,44.19 29.97,43.94
  Top 0.406: v63.5,30.48 63.5,22.86 U$1.3V3W1@4 63.5,20.32 v63.5,17.78 | v63.5,48.26 63.5,43.18 U$1.3V3W1@2
  Top 0.61: v13.46,55.88 12.95,55.88
  Top 1.016: U6.2 v28.07,62.36 | v25.53,66.55 28.02,66.55 U6.4
  Bottom 0.203: v46.74,42.93 46.74,45.47 45.97,46.23 v43.69,46.23 | U$1.JTAG_REF v53.34,62.48
  Bottom 0.254: 38.35,29.21 v38.61,29.21
  Bottom 0.406: v63.5,48.26 58.42,48.26 U$1.3V3W1@1 | v63.5,30.48 58.42,30.48 U$1.3V3W1@3 | v28.96,27.18 v31.24,27.18 v36.32,27.18 38.35,29.21 | v37.85,33.27 v37.85,35.05 | v22.61,33.02 v22.61,35.81 | v29.72,42.93 v32,42.93
  Bottom 0.61: v13.46,55.88 23.37,45.97 v23.37,44.7 v23.37,43.05
  Bottom 1.016: v25.53,66.55 28.07,66.55 v28.07,62.36 | v39.62,69.6 v39.62,70.48 v39.62,77.72 v39.62,78.61
  pour Top (isolate 0.254, rank 3): 0,80.01 0,0 68.58,0 68.58,80.01
3V3OUT_A
  Top 0.254: U3.6 49.46,72.33 49.02,72.77 46.99,72.77 46.23,73.53 46.23,74.04 45.21,75.06 C5.2
5V  (via drill 0.38)
  Top 0.254: 57.83,66.2 arc90 C11.2 57.11,66.83 U3.42 50.96,66.83 U3.3 50.96,72.14 50.46,72.14 | R7.2 arc90 57.81,70.82 v59.22,70.82 | 59.74,76.39 C3.2 59.26,75.95 U1.6 56.95,77.8 56.9,77.85 56.28,77.85 R1.1 | 50.46,72.14 U3.4 | 50.46,72.14 50.46,73.62 50.04,74.04 50.04,74.06 C4.2
  Top 0.406: U6.3 30.48,60.3 | U$1.VIW2@2 2.54,27.94 2.54,35.56 4.32,37.34 4.32,45.72 3.81,46.23 U$1.VIW2@1 2.16,46.99 v2.16,56.26 | U$1.VIW1@4 64.77,25.53 64.39,25.91 64.39,30.1 67.31,33.02 67.31,43.18 66.04,44.45 U$1.VIW1@2 64.77,47.24 64.39,47.62 v64.39,61.34 | v59.22,66.2 57.83,66.2 | v59.74,75.03 59.74,76.39
  Top 1.016: 30.35,60.4 U6.3 30.38,62.74 | v12.09,63.04 12.09,63.93 15.24,63.93 15.73,63.93 | 15.73,63.93 21.49,63.93 21.59,63.93 | 21.59,63.93 23.24,63.93 23.62,63.93 30.38,63.93 30.38,62.74 | 15.73,63.93 C8.1 15.73,68.2 15.37,68.2 15.37,69.34 R5.2 | PWRSELECT.2 35.18,63.5 35.18,62.74 30.38,62.74 | 21.59,63.93 21.49,63.83
  Bottom 0.254: v59.22,66.2 59.22,66.15
  Bottom 0.406: U$1.VIW1@1 58.42,45.72 64.77,45.72 U$1.VIW1@2 | U$1.VIW1@4 63.5,25.4 58.42,25.4 U$1.VIW1@3 | v59.22,66.2 v59.22,70.82 59.22,75.03 v59.74,75.03 | 59.22,66.15 C11.2 | v64.39,61.34 64.39,65.66 63.37,66.67 59.7,66.67 v59.22,66.2 | v12.09,63.04 12.09,62.99 2.16,62.99 v2.16,56.26 | PWRSELECT.2 48.39,63.5 48.39,67.06 59.22,67.06 v59.22,66.2
A0
  Top 0.203: U8.7 24.22,18.61 U9.1
A1
  Top 0.203: U9.2 23.39,17.76 23.11,18.03 23.11,18.92 23.72,19.53 U8.6
A2
  Top 0.203: U9.3 24.96,16.96 25.27,17.27 25.27,19.3 24.72,19.86 U8.8
A3
  Top 0.203: U9.4 25.43,16.16 25.78,16.51 25.78,19.56 25.22,20.12 U8.9
A4
  Top 0.203: U9.5 26.16,15.36 26.29,15.49 26.29,19.81 25.72,20.38 U8.10
A5
  Top 0.203: U8.141 17.39,28.31 16.76,27.69 16.76,11.18 22.98,4.96 U9.18
A6
  Top 0.203: U9.19 23.02,4.16 16.26,10.92 16.26,27.94 17.13,28.81 U8.140
A7
  Top 0.203: U9.20 23.06,3.36 15.75,10.67 15.75,28.19 16.86,29.31 U8.139
A8
  Top 0.203: U9.21 23.09,2.56 15.24,10.41 15.24,28.45 16.6,29.81 U8.138
A9
  Top 0.203: U8.137 16.34,30.31 14.73,28.7 14.73,10.16 23.11,1.78 24.15,1.78 U9.22
A10
  Top 0.203: U8.46 44.38,31.31 46.48,29.21 46.48,22.22 43.43,19.18 43.43,7.37 37.83,1.76 U9.23
A11
  Top 0.203: U8.45 42.34,30.81 42.42,30.73 44.2,30.73 45.97,28.96 45.97,22.35 42.93,19.3 42.93,7.62 37.87,2.56 U9.24
A12
  Top 0.203: U8.44 42.59,30.31 42.67,30.23 43.94,30.23 45.47,28.7 45.47,22.48 42.42,19.43 42.42,7.87 37.9,3.36 U9.25
A13
  Top 0.203: U9.26 37.94,4.16 41.91,8.13 41.91,19.56 44.96,22.61 44.96,28.45 43.6,29.81 U8.43
A14
  Top 0.203: U8.41 42.31,28.81 43.18,27.94 43.18,21.46 41.4,19.68 41.4,8.38 37.98,4.96 U9.27
A15
  Top 0.203: U9.42 35.71,17.02 34.54,17.02 34.29,17.27 34.29,22.48 35.22,23.41 U8.29
A16
  Top 0.203: U8.30 35.72,23.28 34.8,22.35 34.8,18.03 35.05,17.78 35.75,17.78 U9.43
A17
  Top 0.203: U8.32 36.72,22.71 38.35,21.08 38.35,19.3 37.61,18.56 U9.44
A18
  Top 0.203: U9.28 38.02,5.76 40.89,8.64 40.89,19.94 42.67,21.72 42.67,27.81 42.17,28.31 U8.40
BHE
  Top 0.203: U8.26 33.72,23.31 33.27,22.86 33.27,15.88 33.79,15.36 U9.40
BLE
  Top 0.203: U8.24 32.72,15.54 33.7,14.56 U9.39
CS
  Top 0.203: U9.6 26.12,14.56 26.8,15.24 26.8,20.07 26.22,20.64 U8.11
D0
  Top 0.203: U9.7 26.08,13.76 27.3,14.99 27.3,20.32 26.72,20.9 U8.12
D1
  Top 0.203: U9.8 26.04,12.96 27.72,14.64 U8.14
D2
  Top 0.203: U9.9 26,12.16 28.22,14.38 U8.15
D3
  Top 0.203: U9.10 24.2,11.33 25.88,11.33 28.72,14.17 U8.16
D4
  Top 0.203: U8.5 23.22,19.67 21.34,17.78 21.34,10.41 22.73,9.02 22.79,8.96 U9.13
D5
  Top 0.203: U8.2 21.72,23.25 20.83,22.35 20.83,10.16 22.83,8.16 U9.14
D6
  Top 0.203: U8.1 21.22,23.51 20.32,22.61 20.32,9.91 22.87,7.36 U9.15
D7
  Top 0.203: U8.143 17.91,27.31 17.78,27.18 17.78,11.68 22.9,6.56 U9.16
D8
  Top 0.203: U9.29 38.06,6.56 40.39,8.89 40.39,20.07 42.16,21.84 42.16,27.69 42.04,27.81 U8.39
D9
  Top 0.203: U8.35 38.22,23.5 39.88,21.84 39.88,9.14 38.09,7.36 U9.30
D10
  Top 0.203: U8.34 37.72,23.24 39.37,21.59 39.37,9.4 38.13,8.16 U9.31
D11
  Top 0.203: U8.33 37.22,22.98 38.86,21.34 38.86,9.65 38.17,8.96 U9.32
D12
  Top 0.203: U9.35 33.98,11.36 30.73,14.61 30.73,17.78 29.22,19.29 U8.17
D13
  Top 0.203: U9.36 33.81,12.16 31.22,14.75 U8.21
D14
  Top 0.203: U9.37 33.78,12.96 31.72,15.01 U8.22
D15
  Top 0.203: U9.38 33.74,13.76 32.22,15.28 U8.23
D+
  Top 0.254: R2.1 40.77,76.96 38.73,74.93 34.04,74.93 33.02,73.91 USB.3
D-
  Top 0.254: USB.2 33.82,72.55 34.16,72.9 36.2,72.9 36.45,73.15 R6.1
DO_A
  Top 0.254: U1.1 53.95,75.95 53.95,76.71 | R4.1 53.8,76.56 53.95,76.71 | 53.95,76.71 53.95,77.68 R1.2
EECS_A
  Top 0.254: U3.48 53.46,69.98 52.96,70.48 52.96,71.75 53.59,72.39 57.15,72.39 58.42,73.66 58.42,74.55 57.91,75.06 57,75.06 U1.5
EEDATA_A
  Top 0.254: U3.2 51.46,73.66 51.46,74.05 | 51.46,74.05 51.46,74.56 R4.2 | 51.46,74.05 U1.3
EESK
  Top 0.254: U3.1 51.96,72.41 52.7,73.15 55.03,73.15 55.03,73.19 55.88,74.04 56.94,74.04 U1.4
FILTERED_VCC_A
  Top 0.2: C7.2 R7.1
  Top 0.254: U3.46 55.6,68.83 C7.2
FLASH_CS  (via drill 0.38)
  Top 0.203: v37.34,30.99 37.34,28.45 38.48,27.31 U8.38 | U7.1 43.99,41.2 v42.93,40.13
  Bottom 0.203: v42.93,40.13 42.67,40.13 41.91,39.37 36.83,39.37 35.56,38.1 35.56,32.77 v37.34,30.99
FLASH_SCK
  Top 0.203: U7.6 46.74,46.74 46.23,46.23 44.96,46.23 43.94,45.21 43.18,45.21 42.42,44.45 42.42,43.69 42.04,43.31 U8.70
FLASH_SI  (via drill 0.38)
  Top 0.203: U7.5 48.01,45.21 47.5,44.7 v45.21,44.7 | U8.64 38.18,40.31 37.85,40.64 37.85,42.67 v38.35,43.18
  Bottom 0.203: v38.35,43.18 39.88,44.7 v45.21,44.7
FLASH_SO
  Top 0.203: U7.2 45.47,42.67 45.21,42.93 43.43,42.93 42.93,42.42 42.93,41.66 42.08,40.81 U8.65
GND  (via drill 0.38)
  Top 0.2: v47.96,69.52 U3.9 | U3.18 v46.27,67.33 | v52.16,68.33 U3.45 | v52.16,69.33 U3.47
  Top 0.203: U8.113 20.05,42.31 v20.57,41.78 | v21.46,45.09 21.22,45.33 U8.108 21.22,47.87 20.83,48.26 19.3,48.26 OSC.2@2 | U8.96 27.22,45 v27.18,44.96 | U8.91 29.72,44.96 v29.46,44.7 | U8.77 36.72,44.98 v36.7,44.96 | U8.73 38.72,45.07 v38.61,44.96 | U8.68 39.52,42.31 v39.37,42.16 | U8.60 39.41,38.31 v39.37,38.35 | U8.49 39.41,32.81 v39.37,32.77 | U8.25 33.22,26.11 v33.27,26.16 | U8.13 27.22,26.12 v27.18,26.16 | U8.144 20.46,26.81 v20.57,26.92 | U8.136 20.5,30.81 v21.08,30.23 | U9.12 26.05,9.76 v26.16,9.65 | C25.2 v44.07,25.15 | C23.2 37.55,19.77 v37.59,19.81 | v13.72,25.65 C22.2 | C27.2 40.8,45.81 v40.89,45.72 | U7.4 v48.01,42.93 | C30.2 v37.59,13.46 | v50.96,64.39 U3.34 | U9.34 32.11,10.56 v32,10.67 | U8.130 20.04,33.81 v20.83,33.02 | U8.54 39.62,35.31 v39.12,35.81 | C19.2 48.51,34.95 v49.28,34.19 | C21.2 50.06,32.94 v50.77,32.23 | C14.2 20.46,62.34 LED1.C | SW1.B' SW1.B v55.16,8.16 v55.17,8.15 | U8.3 v22.22,26.41 v22.23,26.42
  Top 0.25: C12.1 v66.09,66.41 | v66.09,68.75 C6.1
  Top 0.254: C7.1 55.63,70.87 54.48,70.87 | 54.48,70.87 v54.1,70.87 | C11.1 57.78,64.26 v59.18,64.26 | U1.2 53.09,75 v53.09,74.93 | v61.71,75.02 C3.1 | C5.1 41.53,75.06 v40.89,74.42 | C4.1 49.53,77.09 v48.64,77.98 | U3.25 46.46,62.08 v46.1,61.72 | U3.47 54.48,69.33 54.48,70.87 | C26.2 v30.23,19.56 | C28.2 22.23,19.94 v21.59,19.3 | C18.2 v40.64,21.59 | C16.2 v40.89,49.53 | C15.2 v31.75,54.36 | C24.2 30.1,53.72 v30.73,54.36 | C17.2 v23.62,51.56 | C29.2 12.7,33.78 v12.45,33.53 | C31.2 13.21,35.31 v12.45,34.54
  Top 0.406: C9.1 33.21,65.66 31.42,65.66 USB.5 | v49.91,65.91 v49.91,68.2
  Top 0.61: U2.1 20.55,67.84 v22.86,65.53
  Top 1.016: v25.78,62.36 25.76,62.36 25.76,62.34 | 25.76,62.34 U6.1 | C14.2 25.76,62.34 | C10.2 R9.2 3.17,73 PWR1.2 | C8.2 13.73,68.31 v13.72,68.33 | U4.1 3.81,60.4 U$1.GNDW2@1 | C9.1 33.23,64.81 v33.73,64.31 | v32.73,64.31 32.73,64.35 33.15,64.77 | C1.2 19.05,75.83 v19.05,74.17 19.05,69.29 U2.1 | C2.2 24.53,77.83 v24.51,77.85 | PWR.C 15.33,72.64 16.76,72.64 PWRIN.2
  Bottom 0.203: v20.57,41.78 20.83,41.78 | v21.46,45.09 21.59,45.09 | v27.18,44.96 26.92,44.96 | v29.46,44.7 29.72,44.7 | v39.37,38.35 39.37,38.61 | v39.37,32.77 39.12,32.77 | v33.27,26.16 33.27,26.42 | v27.18,26.16 27.18,26.42 | v26.16,9.65 26.42,9.65 | v37.59,19.81 37.59,20.07 | v40.89,45.72 41.15,45.72 | v48.01,42.93 47.75,42.93 | v37.59,13.46 37.59,13.72 | U$1.JTAG_GND 50.8,64.22 v50.96,64.39 | v32,10.67 32,10.92 | v20.83,33.02 20.57,33.02 | v55.17,8.15 55.17,8.46
  Bottom 0.254: v59.18,64.26 59.18,64.64 | 21.59,18.54 v21.59,19.3 | v40.89,49.53 41.15,49.53 | v31.75,54.36 32,54.36 | v30.73,54.36 30.48,54.36 | v12.45,33.53 12.7,33.53 | v12.45,34.54 12.7,34.54
  Bottom 0.61: v22.86,65.53 v23.62,65.53 23.88,65.53
  pour Bottom (isolate 0.305, rank 3): 0,80.01 68.58,80.01 68.58,0 0,0
LED1
  Top 0.203: R37.2 18.53,57.13 15.49,54.1 15.49,44.7 17.39,42.81 U8.112
N$1
  Top 1.016: R5.1 17.38,71.25 PWR.A
N$2
  Top 0.254: RX.C R12.2
N$3
  Top 0.254: TX.C R13.2
N$4
  Top 0.254: U3.27 47.46,61.12 47.62,60.96 54.61,60.96 55.24,60.33 55.24,59.69 55.88,59.05 R13.1
N$5
  Top 0.254: U3.28 47.96,61.89 48.26,61.6 56.2,61.6 56.2,61.55 R12.1
N$7
  Top 0.203: LED1.A 16.48,58.22 R37.1
N$15_A
  Top 0.254: U3.5 49.96,72.85 49.4,73.41 48.01,73.41 47.62,73.79 R3.2
OE
  Top 0.203: U9.41 34.13,16.16 33.78,16.51 33.78,22.61 34.22,23.05 U8.27
OSC_IN
  Top 0.203: OSC.3@3 19.2,52.22 17.78,50.8 17.78,46.74 19.3,45.21 20.07,45.21 21.34,43.94 27.69,43.94 28.22,44.48 U8.94
REBOOT  (via drill 0.38)
  Top 0.203: R33.1 46.13,13.73 SW1.A' SW1.A | v41.02,25.91 41.02,26.76 U8.37
  Top 0.254: R33.1 47.13,17.64 JP4.1
  Bottom 0.203: JP4.1 46.99,19.05 48.26,20.32 48.26,29.21 45.72,31.75 40.13,31.75 39.62,31.24 39.62,27.3 v41.02,25.91
TCK
  Top 0.203: R11.2 41.15,62.63 41.15,61.98 41.4,61.72 42.93,61.72 44.45,60.2 44.45,58.5 44.53,58.42 | U$1.JTAG_TCK 46.99,58.42 44.53,58.42 | 44.53,58.42 40.89,58.42 40.64,58.17 28.7,58.17 25.15,54.61 18.29,54.61 16.76,53.09 16.76,45.72 17.53,44.96 18.22,44.96 U8.109
TDI  (via drill 0.38)
  Top 0.203: v38.61,58.93 38.35,58.67 28.45,58.67 24.89,55.12 17.53,55.12 16.26,53.85 16.26,45.21 17.66,43.81 U8.110
  Top 0.254: R10.2 39.88,64.77 39.62,64.52 39.62,62.1 40.77,60.96 41.91,60.96 U$1.JTAG_TDI
  Bottom 0.203: v38.61,58.93 38.61,59.69 39.88,60.96 41.91,60.96 U$1.JTAG_TDI
TDO  (via drill 0.38)
  Top 0.203: 45.28,65.33 46.18,65.33 v46.23,65.28 | v39.12,68.07 36.07,68.07 v35.56,68.58 | v20.83,53.85 20.83,53.59 22.22,52.2 U8.106
  Top 0.254: U3.22 45.28,65.33 45.92,65.33 46.35,64.9 46.35,64.26 45.72,63.63 45.72,62.99 44.83,62.1 44.83,61.47 45.72,60.58 U$1.JTAG_TDO
  Bottom 0.203: v46.23,65.28 41.91,65.28 v39.12,68.07 | v35.56,68.58 24.38,68.58 20.83,65.02 v20.83,53.85
TMS  (via drill 0.38)
  Top 0.203: U8.107 21.72,49.91 v21.08,50.55
  Top 0.254: R8.2 39.75,66.67 38.99,65.91 38.99,61.72 40.64,60.07 U$1.JTAG_TMS
  Bottom 0.203: U$1.JTAG_TMS 40.64,59.44 39.12,57.91 26.16,57.91 21.08,52.83 v21.08,50.55
USB_RXD  (via drill 0.38)
  Top 0.203: U3.39 54.31,65.33 v54.61,65.02 | U8.105 22.72,53.2 v22.86,53.34
  Bottom 0.203: v54.61,65.02 54.61,58.17 53.85,57.4 26.92,57.4 v22.86,53.34
USB_TCK
  Top 0.254: U3.24 44.96,63.38 44.45,62.87 R11.1
USB_TDI
  Top 0.254: U3.23 42.97,64.83 R10.1
USB_TMS
  Top 0.254: U3.21 43.76,65.83 R8.1
USB_TXD  (via drill 0.38)
  Top 0.203: U3.40 55.33,65.83 v55.88,65.28 | U8.101 24.72,53.26 v24.38,53.59
  Bottom 0.203: v55.88,65.28 55.88,58.17 54.36,56.64 27.43,56.64 v24.38,53.59
USBDM_A
  Top 0.254: U3.8 48.46,72.06 48.26,72.26 46.23,72.26 45.34,73.15 R6.2
USBDP_A  (via drill 0.38)
  Top 0.254: U3.7 48.96,69.28 v49.02,69.21 | R3.1 47.61,76.58 | R3.1 47.51,76.45 | 46.1,76.56 46.23,76.56 R3.1 | v46.1,75.69 46.1,76.56 | R2.2 44.18,76.56 46.1,76.56
  Bottom 0.254: v49.02,69.21 49.02,75.69 v46.1,75.69
VBUS_A  (via drill 0.38)
  Top 0.406: 34.62,67.69 USB.1 | 34.62,67.69 34.54,67.69 | 34.62,67.69 v34.67,67.69 33.23,67.69 C9.2
  Bottom 0.406: 34.54,67.69 v34.67,67.69 34.8,67.69 34.8,60.96 PWRSELECT.1
VI  (via drill 0.38)
  Top 1.016: C1.1 22.1,77.83 22.1,75.49 U2.4 | U2.4 22.86,75.56 | U2.2 v22.86,72.39 U2.4
  Bottom 1.016: v22.86,72.39 22.86,70.48 36.96,70.48 PWRSELECT.3
VI_PWRJACK  (via drill 0.38)
  Top 1.016: C2.1 v26.04,74.04 v26.04,73.02 26.04,71.75 25.15,70.87 25.15,69.32 U2.3
  Bottom 1.016: v26.04,73.02 v26.04,74.04 C2.1 26.04,76.2 20.32,76.2 20.32,76.96 PWRIN.1 14.94,76.96 PWR1.3
W1_A1
  Top 0.203: U$1.A1@1 61.21,16.51 59.69,18.03 53.85,18.03 51.05,20.83 51.05,29.46 50.29,30.23 48.77,30.23 48.01,30.99 46.23,30.99 44.91,32.31 U8.48
W1_A2
  Top 0.203: U$1.A2@1 61.21,19.05 60.2,20.07 57.4,20.07 56.64,19.3 54.1,19.3 52.07,21.34 52.07,29.97 50.8,31.24 49.28,31.24 48.51,32 46.74,32 44.93,33.81 U8.51
W1_A3
  Top 0.203: U$1.A3@1 60.96,22.86 58.67,22.86 56.13,20.32 54.61,20.32 53.09,21.84 53.09,25.15 53.59,25.65 53.59,29.97 53.09,30.48 53.09,32.26 48.51,36.83 45.72,36.83 45.2,36.31 U8.56
W1_A4
  Top 0.203: U8.58 43.15,37.31 43.69,37.85 49.02,37.85 54.1,32.77 54.1,30.99 54.61,30.48 54.61,28.7 55.63,27.69 55.63,26.67 57.15,25.15 61.21,25.15 U$1.A4@1
W1_A5
  Top 0.203: U$1.A5@1 62.23,27.18 61.47,27.18 60.45,28.19 56.64,28.19 55.63,29.21 55.63,30.99 55.12,31.5 55.12,33.27 49.58,38.81 U8.61
W1_A6  (via drill 0.38)
  Top 0.203: U$1.A6@1 60.96,30.48 59.18,30.48 58.42,31.24 58.42,32.26 57.66,33.02 56.9,33.02 55.88,34.04 55.88,35.05 v55.12,35.81 | U8.66 39.02,41.31 v38.86,41.15
  Bottom 0.203: v55.12,35.81 49.53,41.4 39.12,41.4 v38.86,41.15
W1_A7
  Top 0.203: U8.67 42.06,41.81 42.42,42.16 42.42,42.93 43.43,43.94 48.77,43.94 49.53,43.18 49.53,40.39 52.83,37.08 56.39,37.08 58.67,34.8 58.67,33.78 59.69,32.77 61.21,32.77 U$1.A7@1
W1_A8
  Top 0.203: U8.75 37.72,48.39 37.85,48.51 41.4,48.51 42.93,50.04 49.28,50.04 50.55,48.77 50.55,40.89 53.34,38.1 57.91,38.1 58.17,37.85 58.17,36.83 59.69,35.31 61.21,35.31 U$1.A8@1
W1_A9
  Top 0.203: U8.79 35.72,48.68 36.32,49.28 36.32,50.04 37.34,51.05 50.04,51.05 51.56,49.53 51.56,41.4 53.85,39.12 58.42,39.12 59.69,37.85 61.21,37.85 U$1.A9@1
W1_A10
  Top 0.203: U8.81 34.72,48.44 35.81,49.53 35.81,50.29 37.08,51.56 50.29,51.56 52.07,49.78 52.07,41.66 54.1,39.62 56.64,39.62 58.42,41.4 58.67,41.4 59.18,40.89 60.71,40.89 U$1.A10@1
W1_A11
  Top 0.203: U$1.A11@1 60.71,43.43 58.42,43.43 58.17,43.18 58.17,42.67 56.13,40.64 54.61,40.64 53.09,42.16 53.09,50.29 50.8,52.58 35.31,52.58 34.8,52.07 34.8,50.04 33.72,48.96 U8.83
W1_A12
  Top 0.203: U$1.A12@1 61.21,44.45 60.2,45.47 59.18,45.47 58.67,44.96 57.15,44.96 54.1,48.01 54.1,50.8 51.31,53.59 34.8,53.59 33.78,52.58 33.78,50.55 32.72,49.49 U8.85
W1_A13
  Top 0.203: U$1.A13@1 61.21,46.99 60.2,48.01 58.42,48.01 57.91,48.51 56.13,48.51 55.12,49.53 55.12,51.31 51.82,54.61 34.29,54.61 32.77,53.09 32.77,51.05 31.22,49.51 U8.88
W1_A14
  Top 0.203: U$1.A14@1 61.21,49.53 60.2,50.55 58.42,50.55 57.91,51.05 56.64,51.05 56.13,51.56 56.13,51.82 52.32,55.63 29.97,55.63 28.45,54.1 28.45,48.26 28.72,47.99 U8.93
W1_A15
  Top 0.203: U$1.A15@1 62.23,52.32 60.96,52.32 59.69,53.59 59.18,53.59 58.67,54.1 58.67,56.39 58.42,56.64 29.46,56.64 26.22,53.4 U8.98
W1_A16
  Top 0.203: U$1.A16@1 62.23,56.13 60.71,57.66 28.96,57.66 25.22,53.92 U8.100
W1_B1
  Top 0.203: U$1.B1@1 59.69,56.13 58.67,57.15 29.21,57.15 25.72,53.66 U8.99
W1_B2
  Top 0.203: U$1.B2@1 59.69,52.83 59.44,53.09 56.64,53.09 56.13,53.59 56.13,55.12 55.12,56.13 29.72,56.13 26.72,53.14 U8.97
W1_B3
  Top 0.203: U$1.B3@1 58.67,49.53 57.66,50.55 56.13,50.55 55.63,51.05 55.63,51.56 52.07,55.12 30.23,55.12 28.96,53.85 28.96,48.51 29.22,48.25 U8.92
W1_B4
  Top 0.203: U$1.B4@1 58.67,46.99 57.66,48.01 54.86,48.01 54.61,48.26 54.61,51.05 51.56,54.1 34.54,54.1 33.27,52.83 33.27,50.8 31.72,49.25 U8.87
W1_B5
  Top 0.203: U$1.B5@1 56.9,44.45 53.59,47.75 53.59,50.55 51.05,53.09 35.05,53.09 34.29,52.32 34.29,50.29 33.22,49.22 U8.84
W1_B6
  Top 0.203: U$1.B6@1 58.17,41.91 56.39,40.13 54.36,40.13 52.58,41.91 52.58,50.04 50.55,52.07 35.56,52.07 35.31,51.82 35.31,49.78 34.22,48.7 U8.82
W1_B7  (via drill 0.38)
  Top 0.203: U8.80 35.22,45.13 v34.54,44.45
  Bottom 0.203: U$1.B7@1 54.61,39.37 46.99,46.99 37.08,46.99 v34.54,44.45
W1_B8
  Top 0.203: U$1.B8@1 59.69,37.08 58.17,38.61 53.59,38.61 51.05,41.15 51.05,49.28 49.78,50.55 37.59,50.55 36.83,49.78 36.83,49.02 36.22,48.41 U8.78
W1_B9
  Top 0.203: U$1.B9@1 59.69,34.54 56.64,37.59 53.09,37.59 50.04,40.64 50.04,48.26 48.77,49.53 43.69,49.53 42.16,48.01 38.35,48.01 38.22,47.87 U8.74
W1_B10  (via drill 0.38)
  Top 0.203: U8.95 27.69,46.7 v27.69,48.26
  Bottom 0.203: U$1.B10@1 58.42,33.02 52.07,33.02 44.2,40.89 39.88,40.89 39.37,40.39 29.84,40.39 28.19,42.04 28.19,47.5 27.69,48.01 v27.69,48.26
W1_B11
  Top 0.203: U$1.B11@1 59.69,29.72 59.44,29.97 57.91,29.97 57.15,30.73 56.64,30.73 55.63,31.75 55.63,33.53 49.84,39.31 U8.62
W1_B12
  Top 0.203: U$1.B12@1 59.69,27.43 59.44,27.69 56.39,27.69 55.12,28.96 55.12,30.73 54.61,31.24 54.61,33.02 49.28,38.35 43.43,38.35 42.89,37.81 U8.59
W1_B13
  Top 0.203: U$1.B13@1 59.18,24.64 56.9,24.64 55.12,26.42 55.12,27.43 54.1,28.45 54.1,30.23 53.59,30.73 53.59,32.51 48.77,37.34 44.45,37.34 43.92,36.81 U8.57
W1_B14
  Top 0.203: U$1.B14@1 58.17,21.59 56.39,19.81 54.36,19.81 52.58,21.59 52.58,32 48.26,36.32 45.97,36.32 45.46,35.81 U8.55
W1_B15
  Top 0.203: U$1.B15@1 59.18,19.56 57.66,19.56 56.9,18.8 53.85,18.8 51.56,21.08 51.56,29.72 50.55,30.73 49.02,30.73 48.26,31.5 46.48,31.5 45.21,32.77 43.43,32.77 42.89,33.31 U8.50
W1_B16
  Top 0.203: U$1.B16@1 59.69,17.27 59.44,17.53 53.59,17.53 50.55,20.57 50.55,29.21 50.04,29.72 48.51,29.72 47.75,30.48 45.97,30.48 44.64,31.81 U8.47
W2_A1
  Top 0.203: U8.114 17.63,41.81 7.87,51.56 7.87,53.09 U$1.A1@2
W2_A2
  Top 0.203: U8.115 17.11,41.31 U$1.A2@2
W2_A3
  Top 0.203: U8.116 15.83,40.81 7.11,49.53 U$1.A3@2
W2_A4
  Top 0.203: U8.117 14.3,40.31 7.62,46.99 U$1.A4@2
W2_A5
  Top 0.203: U8.118 12.26,39.81 7.62,44.45 U$1.A5@2
W2_A6
  Top 0.203: U8.119 10.47,39.31 7.87,41.91 U$1.A6@2
W2_A7
  Top 0.203: U8.120 6.91,38.81 U$1.A7@2
W2_A8
  Top 0.203: U$1.A8@2 9.4,36.83 10.88,38.31 U8.121
W2_A9
  Top 0.203: U$1.A9@2 8.13,34.29 11.68,37.85 16.76,37.85 17.3,37.31 U8.123
W2_A10
  Top 0.203: U8.124 17.04,36.81 16.51,37.34 12.45,37.34 7.37,32.26 6.86,32.26 U$1.A10@2
W2_A11
  Top 0.203: U$1.A11@2 6.35,29.72 7.11,29.72 8.13,30.73 8.13,32.26 12.7,36.83 16.26,36.83 17.28,35.81 U8.126
W2_A12
  Top 0.203: U8.127 17.01,35.31 16,36.32 12.95,36.32 11.68,35.05 11.68,34.29 8.64,31.24 8.64,27.69 7.62,26.67 U$1.A12@2
W2_A13
  Top 0.203: U8.131 16.55,33.31 16,32.77 10.92,32.77 9.14,30.99 9.14,25.15 8.13,24.13 U$1.A13@2
W2_A14
  Top 0.203: U8.132 16.81,32.81 16.26,32.26 11.18,32.26 9.65,30.73 9.65,24.89 U$1.A14@2
W2_A15
  Top 0.203: U$1.A15@2 6.35,19.3 6.6,19.3 7.87,20.57 7.87,22.35 10.16,24.64 10.16,30.48 11.43,31.75 16.51,31.75 17.07,32.31 U8.133
W2_A16
  Top 0.203: U$1.A16@2 6.35,16.76 6.6,16.76 7.87,18.03 7.87,19.81 8.38,20.32 8.38,22.1 10.67,24.38 10.67,30.23 11.68,31.24 16.76,31.24 17.33,31.81 U8.134
WE
  Top 0.203: U8.142 17.65,27.81 17.27,27.43 17.27,11.43 22.94,5.76 U9.17
XTIN_A
  Top 0.2: U3.43 61.2,67.33 62.15,66.38 X1.2
  Top 0.254: C12.2 62.65,63.08 62.23,63.5 62.23,65.08 X1.2
XTOUT_A
  Top 0.2: U3.44 61.2,67.83 62.15,68.78 X1.1
  Top 0.254: C6.2 63.19,72.08 62.23,71.12 62.23,70.07 X1.1

### Text on the board
tPlace: VI | GND | Jack | USB | 2/16/2012 | Papilio Platform | Papilio Plus | www.GadgetFactory.net | BPC3010 V1.2 | Copyright 2009-2012 | Gadget Factory, LLC
tNames: Reset
Port0: PORTE | PORTA
Port1: PORTB | PORTF
Port2: PORTC
Port3: PORTD